# EAGLE design Single Board 12s baru v2 (EAGLE 9.6.2)
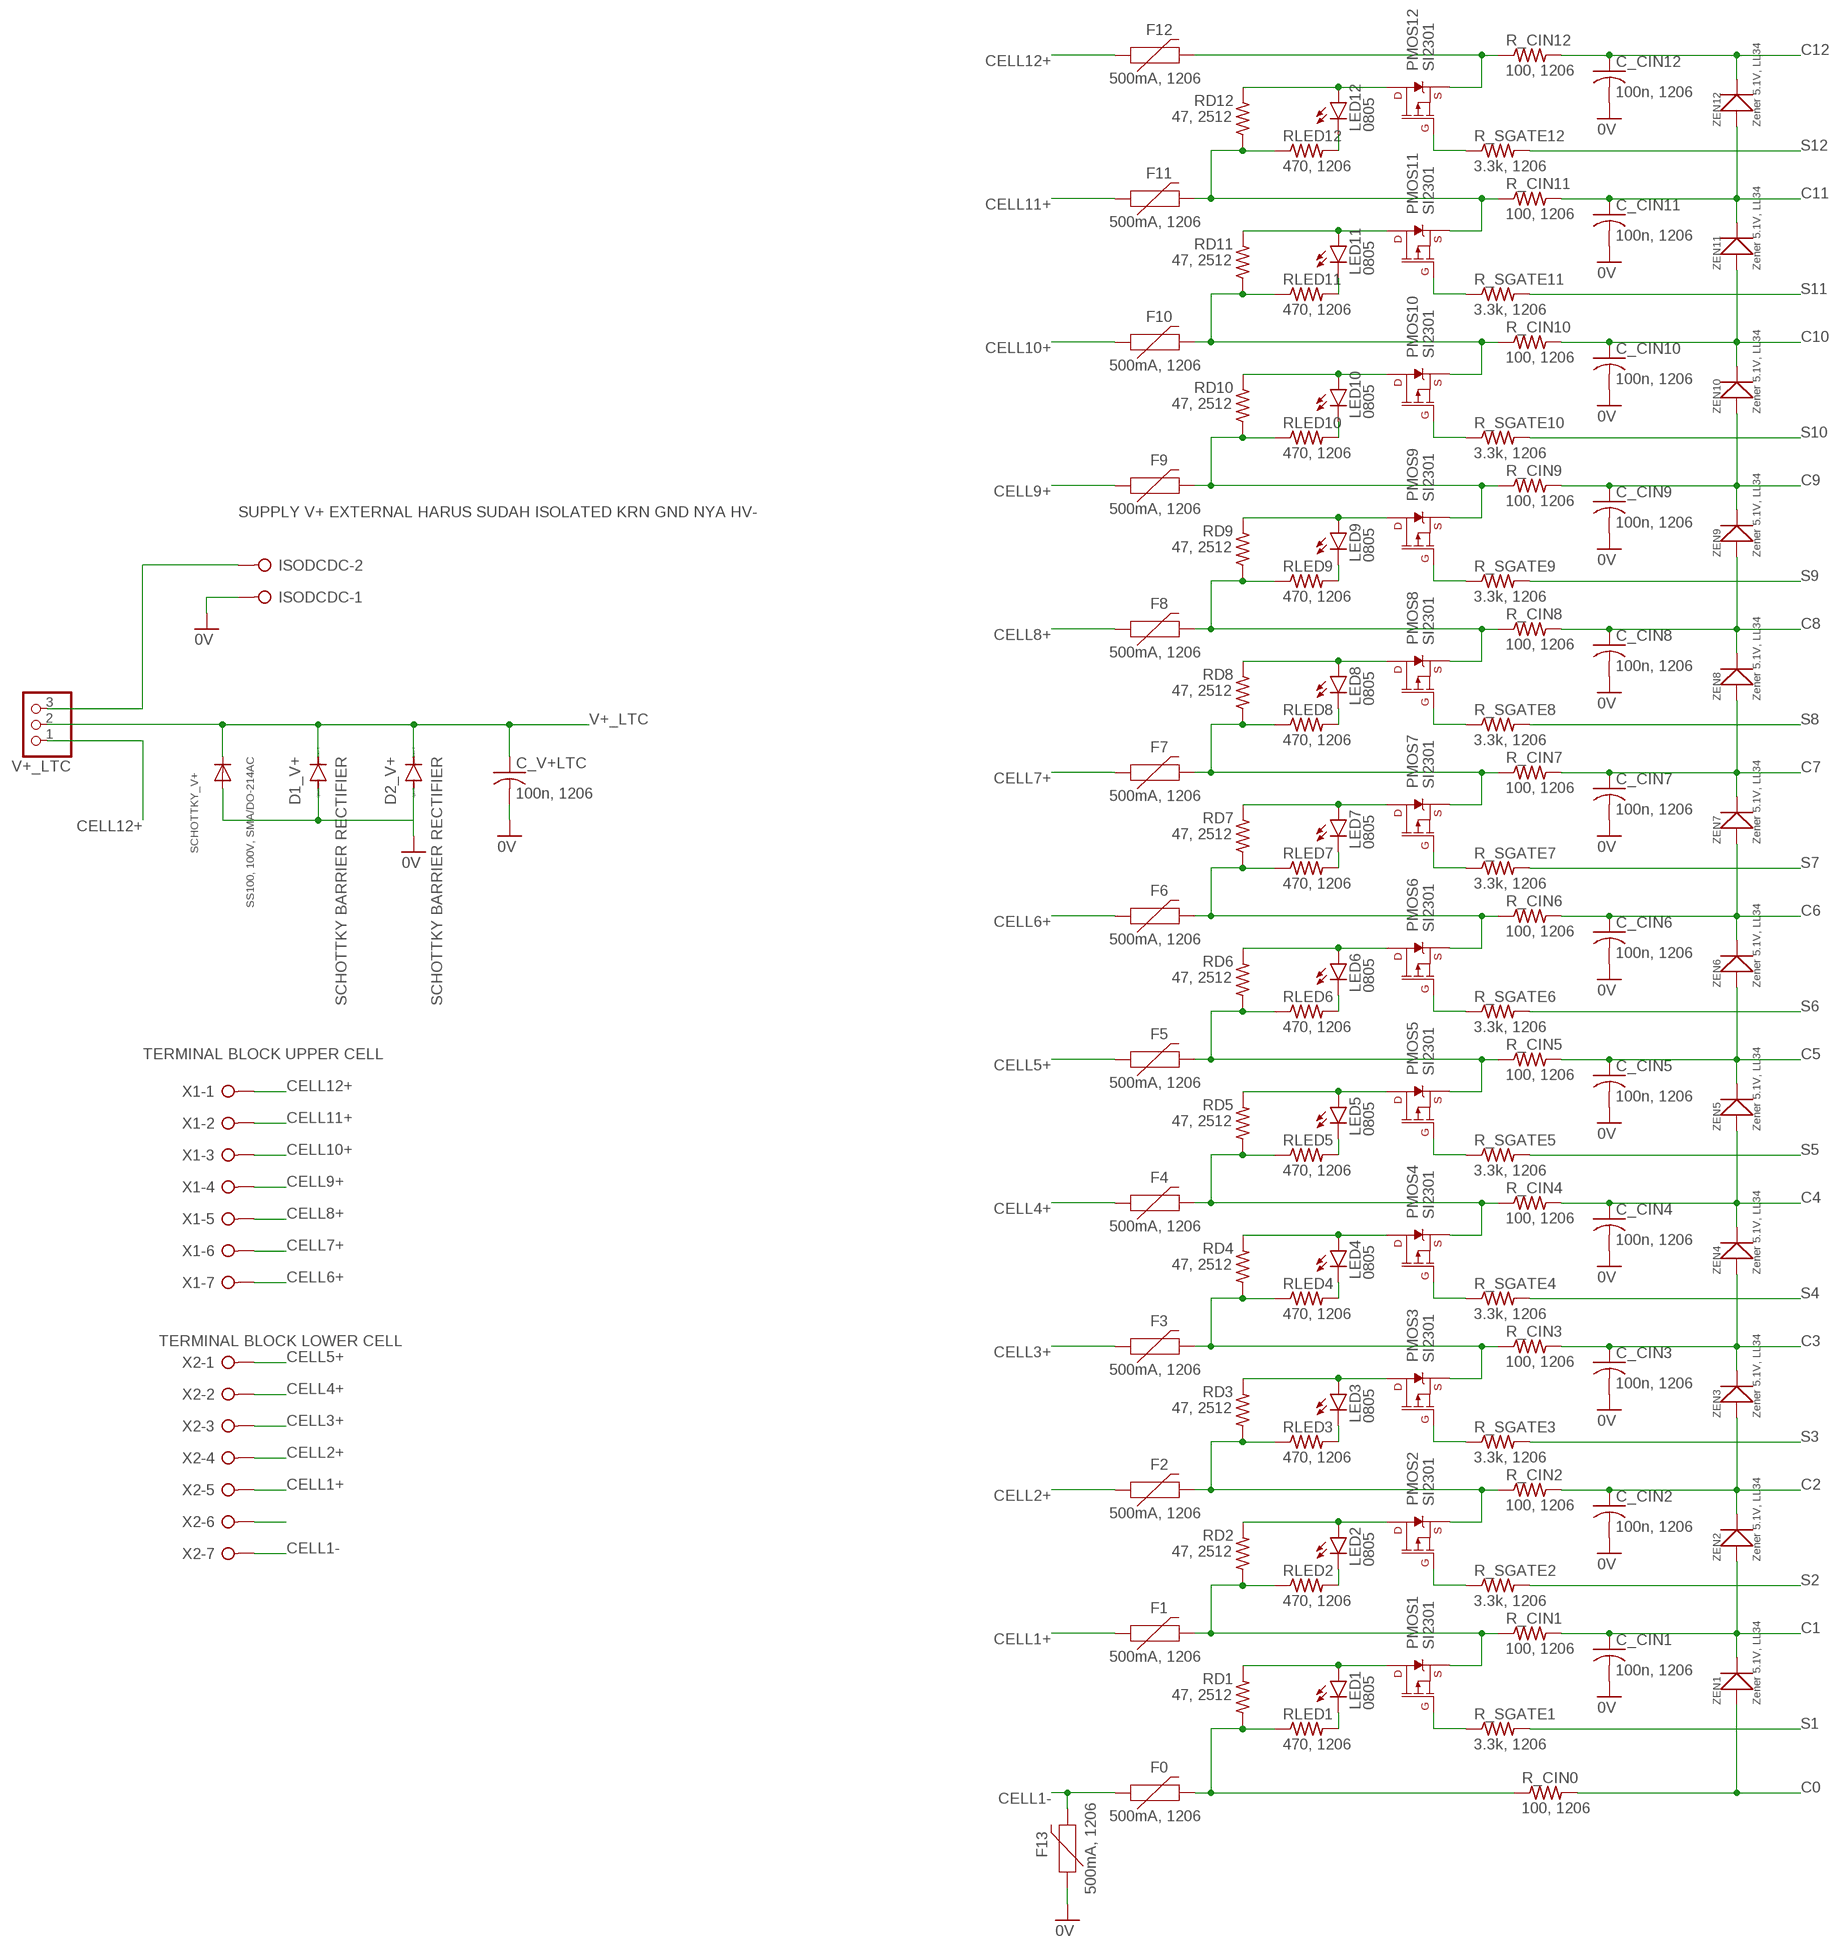
[diagram p0: schematic, sheet 1, part 1 of 2]
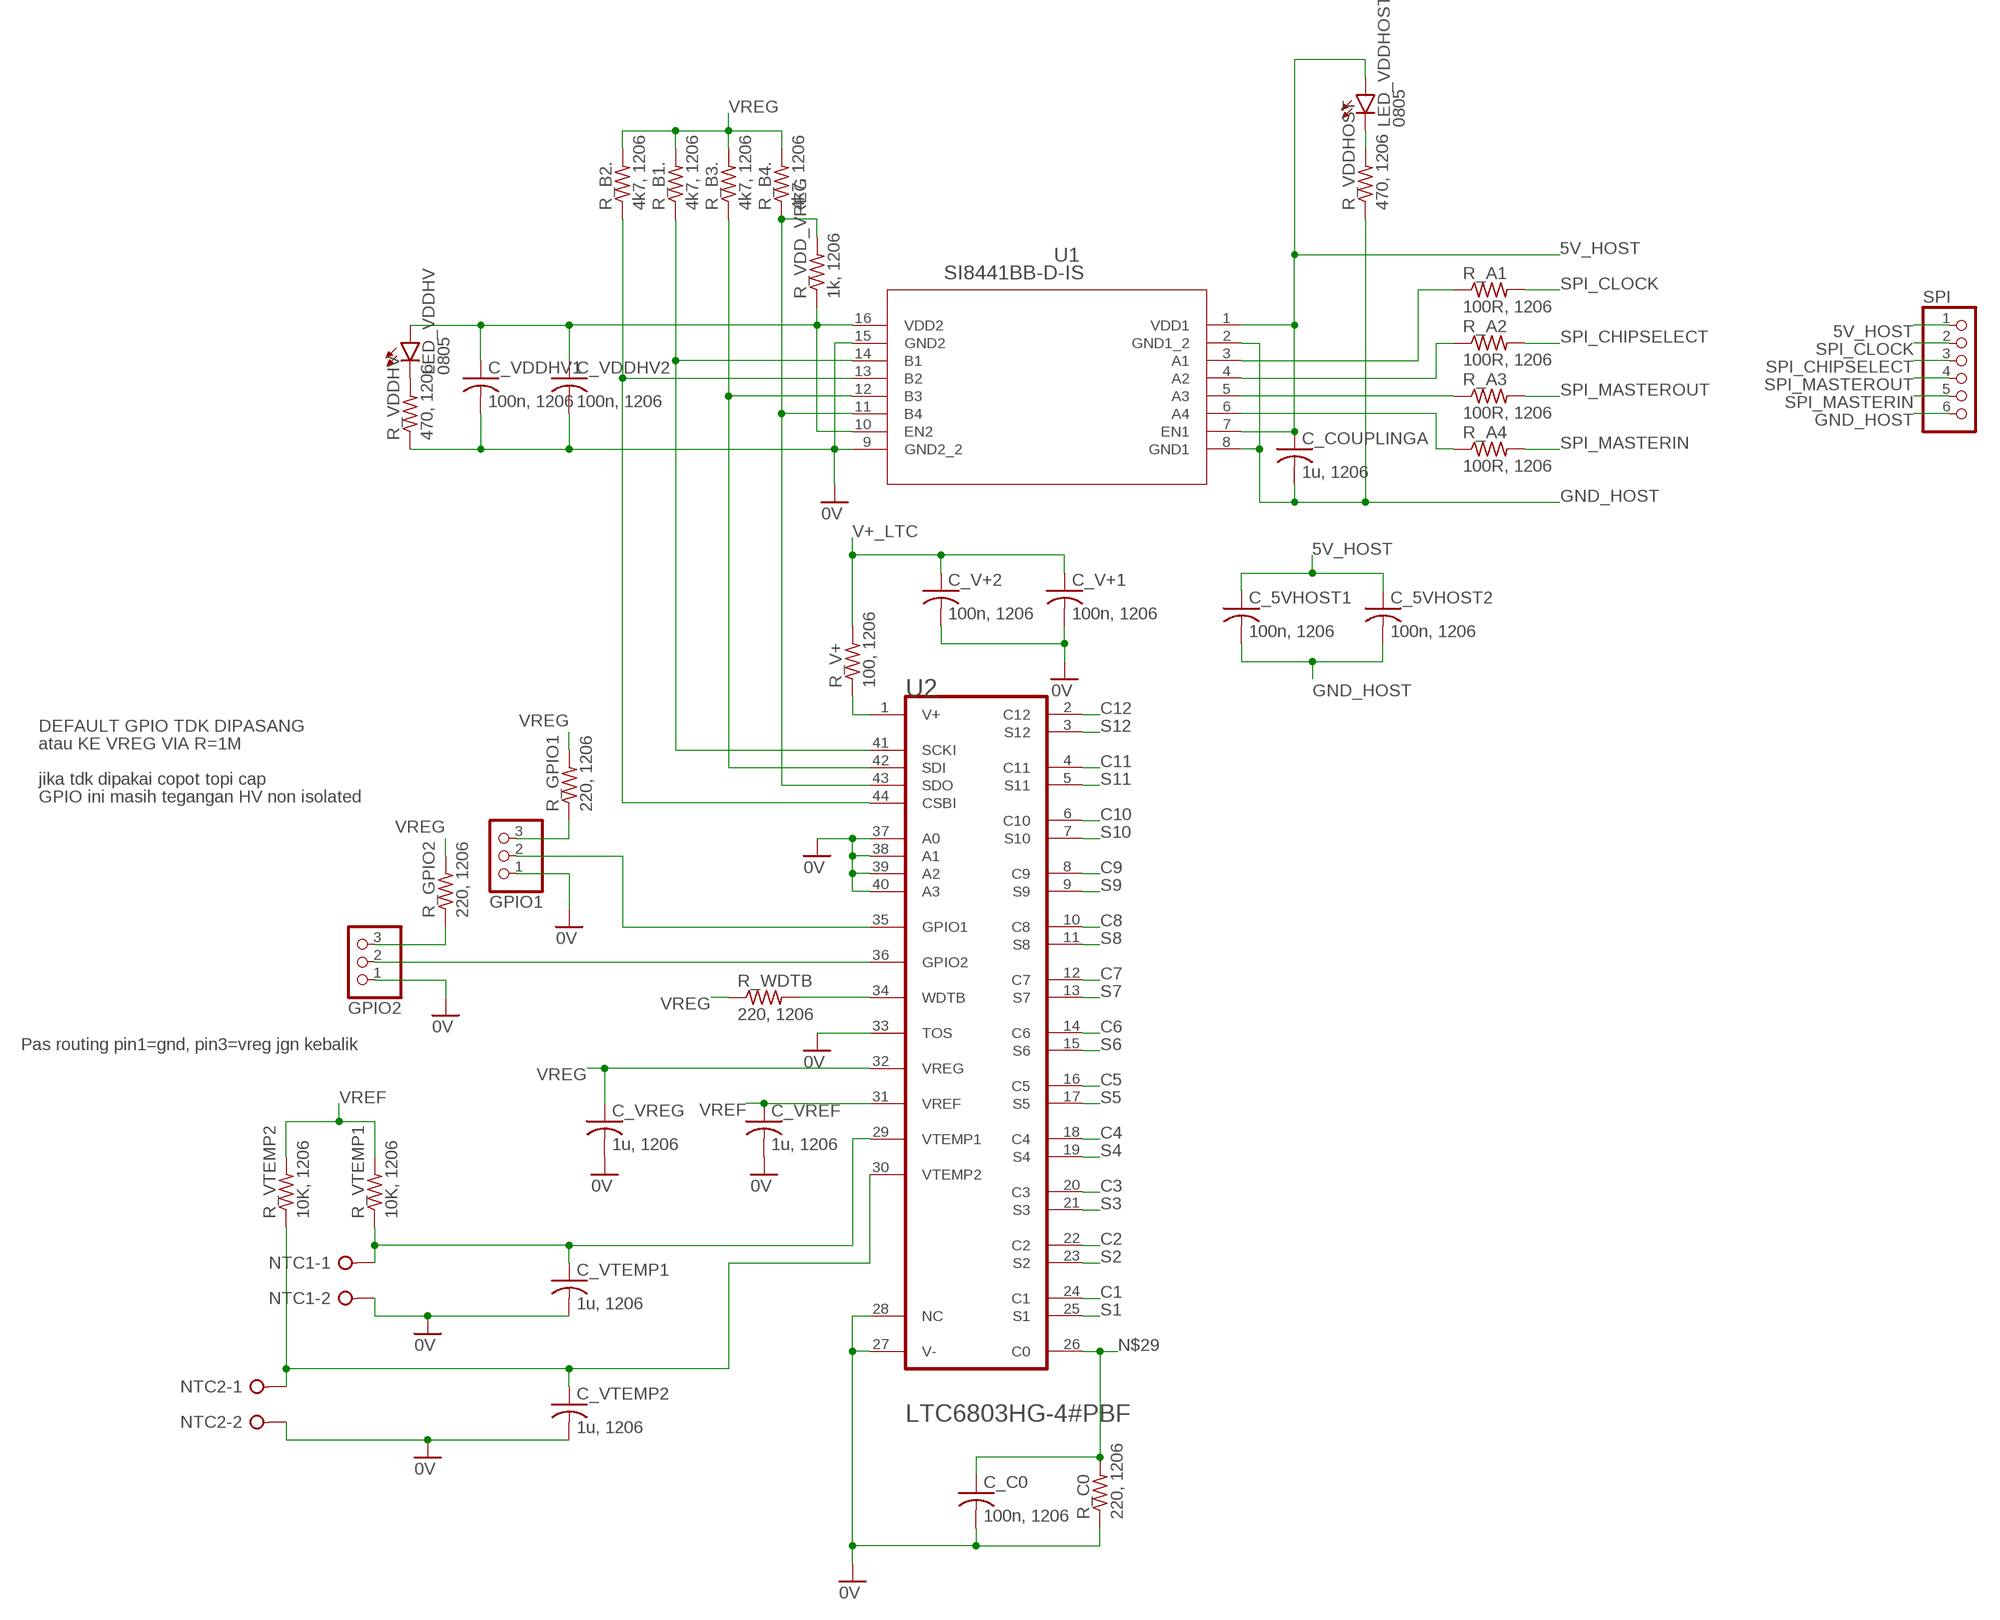
[diagram p1: schematic, sheet 1, part 2 of 2]

## Parts
C_5VHOST1  100n, 1206  C-USC1206  [C1206]
C_5VHOST2  100n, 1206  C-USC1206  [C1206]
C_C0  100n, 1206  C-USC1206  [C1206]
C_CIN1  100n, 1206  C-USC1206  [C1206]
C_CIN2  100n, 1206  C-USC1206  [C1206]
C_CIN3  100n, 1206  C-USC1206  [C1206]
C_CIN4  100n, 1206  C-USC1206  [C1206]
C_CIN5  100n, 1206  C-USC1206  [C1206]
C_CIN6  100n, 1206  C-USC1206  [C1206]
C_CIN7  100n, 1206  C-USC1206  [C1206]
C_CIN8  100n, 1206  C-USC1206  [C1206]
C_CIN9  100n, 1206  C-USC1206  [C1206]
C_CIN10  100n, 1206  C-USC1206  [C1206]
C_CIN11  100n, 1206  C-USC1206  [C1206]
C_CIN12  100n, 1206  C-USC1206  [C1206]
C_COUPLINGA  1u, 1206  C-USC1206  [C1206]
C_V+1  100n, 1206  C-USC1206  [C1206]
C_V+2  100n, 1206  C-USC1206  [C1206]
C_V+LTC  100n, 1206  C-USC1206  [C1206]
C_VDDHV1  100n, 1206  C-USC1206  [C1206]
C_VDDHV2  100n, 1206  C-USC1206  [C1206]
C_VREF  1u, 1206  C-USC1206  [C1206]
C_VREG  1u, 1206  C-USC1206  [C1206]
C_VTEMP1  1u, 1206  C-USC1206  [C1206]
C_VTEMP2  1u, 1206  C-USC1206  [C1206]
D1_V+  SCHOTTKY BARRIER RECTIFIER  DIODE-DO27-15  [DO27-15]
D2_V+  SCHOTTKY BARRIER RECTIFIER  DIODE-DO27-15  [DO27-15]
F0  500mA, 1206  PPTC_6V500MA-2  [1206]
F1  500mA, 1206  PPTC_6V500MA-2  [1206]
F2  500mA, 1206  PPTC_6V500MA-2  [1206]
F3  500mA, 1206  PPTC_6V500MA-2  [1206]
F4  500mA, 1206  PPTC_6V500MA-2  [1206]
F5  500mA, 1206  PPTC_6V500MA-2  [1206]
F6  500mA, 1206  PPTC_6V500MA-2  [1206]
F7  500mA, 1206  PPTC_6V500MA-2  [1206]
F8  500mA, 1206  PPTC_6V500MA-2  [1206]
F9  500mA, 1206  PPTC_6V500MA-2  [1206]
F10  500mA, 1206  PPTC_6V500MA-2  [1206]
F11  500mA, 1206  PPTC_6V500MA-2  [1206]
F12  500mA, 1206  PPTC_6V500MA-2  [1206]
F13  500mA, 1206  PPTC_6V500MA-2  [1206]
GPIO1  PINHD-1X3  [1X03]
GPIO2  PINHD-1X3  [1X03]
ISODCDC  W237-02P  [W237-132]
LED1  0805  LEDSML0805  [SML0805]
LED2  0805  LEDSML0805  [SML0805]
LED3  0805  LEDSML0805  [SML0805]
LED4  0805  LEDSML0805  [SML0805]
LED5  0805  LEDSML0805  [SML0805]
LED6  0805  LEDSML0805  [SML0805]
LED7  0805  LEDSML0805  [SML0805]
LED8  0805  LEDSML0805  [SML0805]
LED9  0805  LEDSML0805  [SML0805]
LED10  0805  LEDSML0805  [SML0805]
LED11  0805  LEDSML0805  [SML0805]
LED12  0805  LEDSML0805  [SML0805]
LED_VDDHOST  0805  LEDSML0805  [SML0805]
LED_VDDHV  0805  LEDSML0805  [SML0805]
NTC1  W237-02P  [W237-132]
NTC2  W237-02P  [W237-132]
PMOS1  SI2301  MOSFET_PCH-SI2309DS  [SOT23-3]
PMOS2  SI2301  MOSFET_PCH-SI2309DS  [SOT23-3]
PMOS3  SI2301  MOSFET_PCH-SI2309DS  [SOT23-3]
PMOS4  SI2301  MOSFET_PCH-SI2309DS  [SOT23-3]
PMOS5  SI2301  MOSFET_PCH-SI2309DS  [SOT23-3]
PMOS6  SI2301  MOSFET_PCH-SI2309DS  [SOT23-3]
PMOS7  SI2301  MOSFET_PCH-SI2309DS  [SOT23-3]
PMOS8  SI2301  MOSFET_PCH-SI2309DS  [SOT23-3]
PMOS9  SI2301  MOSFET_PCH-SI2309DS  [SOT23-3]
PMOS10  SI2301  MOSFET_PCH-SI2309DS  [SOT23-3]
PMOS11  SI2301  MOSFET_PCH-SI2309DS  [SOT23-3]
PMOS12  SI2301  MOSFET_PCH-SI2309DS  [SOT23-3]
R_A1  100R, 1206  R-US_R1206  [R1206]
R_A2  100R, 1206  R-US_R1206  [R1206]
R_A3  100R, 1206  R-US_R1206  [R1206]
R_A4  100R, 1206  R-US_R1206  [R1206]
R_B1.  4k7, 1206  R-US_R1206  [R1206]
R_B2.  4k7, 1206  R-US_R1206  [R1206]
R_B3.  4k7, 1206  R-US_R1206  [R1206]
R_B4.  4k7, 1206  R-US_R1206  [R1206]
R_C0  220, 1206  R-US_R1206  [R1206]
R_CIN0  100, 1206  R-US_R1206  [R1206]
R_CIN1  100, 1206  R-US_R1206  [R1206]
R_CIN2  100, 1206  R-US_R1206  [R1206]
R_CIN3  100, 1206  R-US_R1206  [R1206]
R_CIN4  100, 1206  R-US_R1206  [R1206]
R_CIN5  100, 1206  R-US_R1206  [R1206]
R_CIN6  100, 1206  R-US_R1206  [R1206]
R_CIN7  100, 1206  R-US_R1206  [R1206]
R_CIN8  100, 1206  R-US_R1206  [R1206]
R_CIN9  100, 1206  R-US_R1206  [R1206]
R_CIN10  100, 1206  R-US_R1206  [R1206]
R_CIN11  100, 1206  R-US_R1206  [R1206]
R_CIN12  100, 1206  R-US_R1206  [R1206]
R_GPIO1  220, 1206  R-US_R1206  [R1206]
R_GPIO2  220, 1206  R-US_R1206  [R1206]
R_SGATE1  3.3k, 1206  R-US_R1206  [R1206]
R_SGATE2  3.3k, 1206  R-US_R1206  [R1206]
R_SGATE3  3.3k, 1206  R-US_R1206  [R1206]
R_SGATE4  3.3k, 1206  R-US_R1206  [R1206]
R_SGATE5  3.3k, 1206  R-US_R1206  [R1206]
R_SGATE6  3.3k, 1206  R-US_R1206  [R1206]
R_SGATE7  3.3k, 1206  R-US_R1206  [R1206]
R_SGATE8  3.3k, 1206  R-US_R1206  [R1206]
R_SGATE9  3.3k, 1206  R-US_R1206  [R1206]
R_SGATE10  3.3k, 1206  R-US_R1206  [R1206]
R_SGATE11  3.3k, 1206  R-US_R1206  [R1206]
R_SGATE12  3.3k, 1206  R-US_R1206  [R1206]
R_V+  100, 1206  R-US_R1206  [R1206]
R_VDD_VREG  1k, 1206  R-US_R1206  [R1206]
R_VDDHOST  470, 1206  R-US_R1206  [R1206]
R_VDDHV  470, 1206  R-US_R1206  [R1206]
R_VTEMP1  10K, 1206  R-US_R1206  [R1206]
R_VTEMP2  10K, 1206  R-US_R1206  [R1206]
R_WDTB  220, 1206  R-US_R1206  [R1206]
RD1  47, 2512  R-US_R2512  [R2512]
RD2  47, 2512  R-US_R2512  [R2512]
RD3  47, 2512  R-US_R2512  [R2512]
RD4  47, 2512  R-US_R2512  [R2512]
RD5  47, 2512  R-US_R2512  [R2512]
RD6  47, 2512  R-US_R2512  [R2512]
RD7  47, 2512  R-US_R2512  [R2512]
RD8  47, 2512  R-US_R2512  [R2512]
RD9  47, 2512  R-US_R2512  [R2512]
RD10  47, 2512  R-US_R2512  [R2512]
RD11  47, 2512  R-US_R2512  [R2512]
RD12  47, 2512  R-US_R2512  [R2512]
RLED1  470, 1206  R-US_R1206  [R1206]
RLED2  470, 1206  R-US_R1206  [R1206]
RLED3  470, 1206  R-US_R1206  [R1206]
RLED4  470, 1206  R-US_R1206  [R1206]
RLED5  470, 1206  R-US_R1206  [R1206]
RLED6  470, 1206  R-US_R1206  [R1206]
RLED7  470, 1206  R-US_R1206  [R1206]
RLED8  470, 1206  R-US_R1206  [R1206]
RLED9  470, 1206  R-US_R1206  [R1206]
RLED10  470, 1206  R-US_R1206  [R1206]
RLED11  470, 1206  R-US_R1206  [R1206]
RLED12  470, 1206  R-US_R1206  [R1206]
SCHOTTKY_V+  SS100, 100V, SMA/DO-214AC  DIODESMA  [SMADIODE]
SPI  PINHD-1X6  [1X06]
U1  SI8441BB-D-IS  [SOIC-16W_SIL]
U2  LINEAR_TECHNOLOGY_LTC6803HG-4#PBFLINEAR_TECHNOLOGY_LTC6803HG-4#PBF_0_2  [LINEAR_TECHNOLOGY_LTC6803HG-4#PBF_2]
V+_LTC  PINHD-1X3  [1X03]
X1  W237-07P  [W237-7P]
X2  W237-07P  [W237-7P]
ZEN1  Zener 5.1V, LL34  SMD-DIODE-SWITCHING-75V-200MA(LL-34)  [LL-34]
ZEN2  Zener 5.1V, LL34  SMD-DIODE-SWITCHING-75V-200MA(LL-34)  [LL-34]
ZEN3  Zener 5.1V, LL34  SMD-DIODE-SWITCHING-75V-200MA(LL-34)  [LL-34]
ZEN4  Zener 5.1V, LL34  SMD-DIODE-SWITCHING-75V-200MA(LL-34)  [LL-34]
ZEN5  Zener 5.1V, LL34  SMD-DIODE-SWITCHING-75V-200MA(LL-34)  [LL-34]
ZEN6  Zener 5.1V, LL34  SMD-DIODE-SWITCHING-75V-200MA(LL-34)  [LL-34]
ZEN7  Zener 5.1V, LL34  SMD-DIODE-SWITCHING-75V-200MA(LL-34)  [LL-34]
ZEN8  Zener 5.1V, LL34  SMD-DIODE-SWITCHING-75V-200MA(LL-34)  [LL-34]
ZEN9  Zener 5.1V, LL34  SMD-DIODE-SWITCHING-75V-200MA(LL-34)  [LL-34]
ZEN10  Zener 5.1V, LL34  SMD-DIODE-SWITCHING-75V-200MA(LL-34)  [LL-34]
ZEN11  Zener 5.1V, LL34  SMD-DIODE-SWITCHING-75V-200MA(LL-34)  [LL-34]
ZEN12  Zener 5.1V, LL34  SMD-DIODE-SWITCHING-75V-200MA(LL-34)  [LL-34]

## Nets
0V: C_C0.2 C_CIN1.2 C_CIN2.2 C_CIN3.2 C_CIN4.2 C_CIN5.2 C_CIN6.2 C_CIN7.2 C_CIN8.2 C_CIN9.2 C_CIN10.2 C_CIN11.2 C_CIN12.2 C_V+1.2 C_V+2.2 C_V+LTC.2 C_VDDHV1.2 C_VDDHV2.2 C_VREF.2 C_VREG.2 C_VTEMP1.2 C_VTEMP2.2 D1_V+.A D2_V+.A F13.1 GPIO1.1 GPIO2.1 ISODCDC.1 NTC1.2 NTC2.2 R_C0.1 R_VDDHV.1 SCHOTTKY_V+.A U1.9(GND2_2) U1.15(GND2) U2.27(V-) U2.28(NC) U2.33(TOS) U2.37(A0) U2.38(A1) U2.39(A2) U2.40(A3)
5V_HOST: C_5VHOST1.1 C_5VHOST2.1 C_COUPLINGA.1 LED_VDDHOST.A SPI.1 U1.1(VDD1) U1.7(EN1)
C0: R_CIN0.2 ZEN1.A(+)
C1: C_CIN1.1 R_CIN1.2 U2.24(C1) ZEN1.C(-) ZEN2.A(+)
C2: C_CIN2.1 R_CIN2.2 U2.22(C2) ZEN2.C(-) ZEN3.A(+)
C3: C_CIN3.1 R_CIN3.2 U2.20(C3) ZEN3.C(-) ZEN4.A(+)
C4: C_CIN4.1 R_CIN4.2 U2.18(C4) ZEN4.C(-) ZEN5.A(+)
C5: C_CIN5.1 R_CIN5.2 U2.16(C5) ZEN5.C(-) ZEN6.A(+)
C6: C_CIN6.1 R_CIN6.2 U2.14(C6) ZEN6.C(-) ZEN7.A(+)
C7: C_CIN7.1 R_CIN7.2 U2.12(C7) ZEN7.C(-) ZEN8.A(+)
C8: C_CIN8.1 R_CIN8.2 U2.10(C8) ZEN8.C(-) ZEN9.A(+)
C9: C_CIN9.1 R_CIN9.2 U2.8(C9) ZEN9.C(-) ZEN10.A(+)
C10: C_CIN10.1 R_CIN10.2 U2.6(C10) ZEN10.C(-) ZEN11.A(+)
C11: C_CIN11.1 R_CIN11.2 U2.4(C11) ZEN11.C(-) ZEN12.A(+)
C12: C_CIN12.1 R_CIN12.2 U2.2(C12) ZEN12.C(-)
CELL1+: F1.1 X2.5
CELL1-: F0.1 F13.2 X2.7
CELL2+: F2.1 X2.4
CELL3+: F3.1 X2.3
CELL4+: F4.1 X2.2
CELL5+: F5.1 X2.1
CELL6+: F6.1 X1.7
CELL7+: F7.1 X1.6
CELL8+: F8.1 X1.5
CELL9+: F9.1 X1.4
CELL10+: F10.1 X1.3
CELL11+: F11.1 X1.2
CELL12+: F12.1 V+_LTC.1 X1.1
GND_HOST: C_5VHOST1.2 C_5VHOST2.2 C_COUPLINGA.2 R_VDDHOST.1 SPI.6 U1.2(GND1_2) U1.8(GND1)
N$1: R_V+.1 U2.1(V+)
N$2: PMOS1.1(G) R_SGATE1.1
N$3: LED1.A PMOS1.3(D) RD1.2
N$4: R_A2.1 U1.4(A2)
N$5: LED_VDDHOST.C R_VDDHOST.2
N$6: LED1.C RLED1.2
N$7: F0.2 R_CIN0.1 RD1.1 RLED1.1
N$8: R_WDTB.2 U2.34(WDTB)
N$9: ISODCDC.2 V+_LTC.3
N$10: LED_VDDHV.C R_VDDHV.2
N$12: PMOS2.1(G) R_SGATE2.1
N$15: R_B4..1 R_VDD_VREG.2 U1.11(B4) U2.43(SDO)
N$16: LED2.A PMOS2.3(D) RD2.2
N$17: LED2.C RLED2.2
N$18: F1.2 PMOS1.2(S) R_CIN1.1 RD2.1 RLED2.1
N$19: R_B3..1 U1.12(B3) U2.42(SDI)
N$20: R_B2..1 U1.13(B2) U2.44(CSBI)
N$21: PMOS3.1(G) R_SGATE3.1
N$22: R_B1..1 U1.14(B1) U2.41(SCKI)
N$23: R_A3.1 U1.5(A3)
N$24: R_A1.1 U1.3(A1)
N$25: LED3.A PMOS3.3(D) RD3.2
N$26: LED3.C RLED3.2
N$27: F2.2 PMOS2.2(S) R_CIN2.1 RD3.1 RLED3.1
N$28: R_A4.1 U1.6(A4)
N$29: C_C0.1 R_C0.2 U2.26(C0)
N$30: PMOS4.1(G) R_SGATE4.1
N$31: GPIO2.2 U2.36(GPIO2)
N$32: GPIO1.2 U2.35(GPIO1)
N$33: C_VTEMP2.1 NTC2.1 R_VTEMP2.1 U2.30(VTEMP2)
N$34: LED4.A PMOS4.3(D) RD4.2
N$35: LED4.C RLED4.2
N$36: F3.2 PMOS3.2(S) R_CIN3.1 RD4.1 RLED4.1
N$37: C_VTEMP1.1 NTC1.1 R_VTEMP1.1 U2.29(VTEMP1)
N$38: GPIO2.3 R_GPIO2.1
N$39: PMOS5.1(G) R_SGATE5.1
N$40: GPIO1.3 R_GPIO1.1
N$43: LED5.A PMOS5.3(D) RD5.2
N$44: LED5.C RLED5.2
N$45: F4.2 PMOS4.2(S) R_CIN4.1 RD5.1 RLED5.1
N$48: PMOS6.1(G) R_SGATE6.1
N$51: X2.6
N$52: LED6.A PMOS6.3(D) RD6.2
N$53: LED6.C RLED6.2
N$54: F5.2 PMOS5.2(S) R_CIN5.1 RD6.1 RLED6.1
N$57: PMOS7.1(G) R_SGATE7.1
N$61: LED7.A PMOS7.3(D) RD7.2
N$62: LED7.C RLED7.2
N$63: F6.2 PMOS6.2(S) R_CIN6.1 RD7.1 RLED7.1
N$66: PMOS8.1(G) R_SGATE8.1
N$70: LED8.A PMOS8.3(D) RD8.2
N$71: LED8.C RLED8.2
N$72: F7.2 PMOS7.2(S) R_CIN7.1 RD8.1 RLED8.1
N$75: PMOS9.1(G) R_SGATE9.1
N$79: LED9.A PMOS9.3(D) RD9.2
N$80: LED9.C RLED9.2
N$81: F8.2 PMOS8.2(S) R_CIN8.1 RD9.1 RLED9.1
N$84: PMOS10.1(G) R_SGATE10.1
N$88: LED10.A PMOS10.3(D) RD10.2
N$89: LED10.C RLED10.2
N$90: F9.2 PMOS9.2(S) R_CIN9.1 RD10.1 RLED10.1
N$93: PMOS11.1(G) R_SGATE11.1
N$97: LED11.A PMOS11.3(D) RD11.2
N$98: LED11.C RLED11.2
N$99: F10.2 PMOS10.2(S) R_CIN10.1 RD11.1 RLED11.1
N$102: PMOS12.1(G) R_SGATE12.1
N$105: F12.2 PMOS12.2(S) R_CIN12.1
N$106: LED12.A PMOS12.3(D) RD12.2
N$107: LED12.C RLED12.2
N$108: F11.2 PMOS11.2(S) R_CIN11.1 RD12.1 RLED12.1
S1: R_SGATE1.2 U2.25(S1)
S2: R_SGATE2.2 U2.23(S2)
S3: R_SGATE3.2 U2.21(S3)
S4: R_SGATE4.2 U2.19(S4)
S5: R_SGATE5.2 U2.17(S5)
S6: R_SGATE6.2 U2.15(S6)
S7: R_SGATE7.2 U2.13(S7)
S8: R_SGATE8.2 U2.11(S8)
S9: R_SGATE9.2 U2.9(S9)
S10: R_SGATE10.2 U2.7(S10)
S11: R_SGATE11.2 U2.5(S11)
S12: R_SGATE12.2 U2.3(S12)
SPI_CHIPSELECT: R_A2.2 SPI.3
SPI_CLOCK: R_A1.2 SPI.2
SPI_MASTERIN: R_A4.2 SPI.5
SPI_MASTEROUT: R_A3.2 SPI.4
V+_LTC: C_V+1.1 C_V+2.1 C_V+LTC.1 D1_V+.C D2_V+.C R_V+.2 SCHOTTKY_V+.C V+_LTC.2
VREF: C_VREF.1 R_VTEMP1.2 R_VTEMP2.2 U2.31(VREF)
VREG: C_VDDHV1.1 C_VDDHV2.1 C_VREG.1 LED_VDDHV.A R_B1..2 R_B2..2 R_B3..2 R_B4..2 R_GPIO1.2 R_GPIO2.2 R_VDD_VREG.1 R_WDTB.1 U1.10(EN2) U1.16(VDD2) U2.32(VREG)

## Notes on the sheet
- SUPPLY V+ EXTERNAL HARUS SUDAH ISOLATED KRN GND NYA HV-
- DEFAULT GPIO TDK DIPASANG
- atau KE VREG VIA R=1M
- jika tdk dipakai copot topi cap
- TERMINAL BLOCK UPPER CELL | GPIO ini masih tegangan HV non isolated
- Pas routing pin1=gnd, pin3=vreg jgn kebalik
- TERMINAL BLOCK LOWER CELL

## Library data of the parts
C_5VHOST1 C_5VHOST2 C_C0 C_CIN1-C_CIN12 C_COUPLINGA C_V+1 C_V+2 C_V+LTC C_VDDHV1 C_VDDHV2 C_VREF C_VREG C_VTEMP1 C_VTEMP2 = rcl:C-US: CAPACITOR, American symbol; SPICEPREFIX: C
D1_V+ D2_V+ = diode:DIODE-: DIODE
F0 F1-F13 = SparkFun-Fuses:PPTC: Resettable Fuse PPTC Resettable Fuse. Really a sort of resistor with a polymeric positive temperature coefficient whose resistance increases dramatically with an increase in temperature. When heated by the power passing through the resistance rises causing the current to be limited, protecting the circuit. This is achieved by the transition of the polymer from a crystalline to an amorphous state where the conductive carbon separates breaking the conductive pathways found in the cool crystalline structure. When a PPTC cools back down it resumes conducting letting the circuit turn back on. SparkFun Products: SparkFun RedBoard - Programmed with Arduino <https://www.sparkfun.com/products/12757> Pro Micro - 5V/16MHz <https://www.sparkfun.com/products/12640> Arduino Pro 328 - 5V/16MHz <https://www.sparkfun.com/products/10915> MP3 Trigger <https://www.sparkfun.com/products/13720>; PROD_ID: RES-08585; VALUE: 6V/0.5A
GPIO1 GPIO2 V+_LTC = pinhead:PINHD-1X3: PIN HEADER
ISODCDC NTC1 NTC2 = con-wago-508:W237-02P: WAGO SREW CLAMP; OC_FARNELL: unknown; OC_NEWARK: unknown
LED1-LED12 LED_VDDHOST LED_VDDHV = led:LED: LED OSRAM: - CHIPLED LG R971, LG N971, LY N971, LG Q971, LY Q971, LO R971, LY R971 LH N974, LH R974 LS Q976, LO Q976, LY Q976 LO Q996 - Hyper CHIPLED LW Q18S LB Q993, LB Q99A, LB R99A - SideLED LS A670, LO A670, LY A670, LG A670, LP A670 LB A673, LV A673, LT A673, LW A673 LH A674 LY A675 LS A676, LA A676, LO A676, LY A676, LW A676 LS A679, LY A679, LG A679 - Hyper Micro SIDELED® LS Y876, LA Y876, LO Y876, LY Y876 LT Y87S - SmartLED LW L88C, LW L88S LB L89C, LB L89S, LG L890 LS L89K, LO L89K, LY L89K LS L896, LA L896, LO L896, LY L896 - TOPLED LS T670, LO T670, LY T670, LG T670, LP T670 LSG T670, LSP T670, LSY T670, LOP T670, LYG T670 LG T671, LOG T671, LSG T671 LB T673, LV T673, LT T673, LW T673 LH T674 LS T676, LA T676, LO T676, LY T676, LB T676, LH T676, LSB T676, LW T676 LB T67C, LV T67C, LT T67C, LS T67K, LO T67K, LY T67K, LW E67C LS E67B, LA E67B, LO E67B, LY E67B, LB E67C, LV E67C, LT E67C LW T67C LS T679, LY T679, LG T679 LS T770, LO T770, LY T770, LG T770, LP T770 LB T773, LV T773, LT T773, LW T773 LH T774 LS E675, LA E675, LY E675, LS T675 LS T776, LA T776, LO T776, LY T776, LB T776 LHGB T686 LT T68C, LB T68C - Hyper Mini TOPLED® LB M676 - Mini TOPLED Santana® LG M470 LS M47K, LO M47K, LY M47K Source: http://www.osram.convergy.de LUXEON: - LUMILED® LXK2-PW12-R00, LXK2-PW12-S00, LXK2-PW14-U00, LXK2-PW14-V00 LXK2-PM12-R00, LXK2-PM12-S00, LXK2-PM14-U00 LXK2-PE12-Q00, LXK2-PE12-R00, LXK2-PE12-S00, LXK2-PE14-T00, LXK2-PE14-U00 LXK2-PB12-K00, LXK2-PB12-L00, LXK2-PB12-M00, LXK2-PB14-N00, LXK2-PB14-P00, LXK2-PB14-Q00 LXK2-PR12-L00, LXK2-PR12-M00, LXK2-PR14-Q00, LXK2-PR14-R00 LXK2-PD12-Q00, LXK2-PD12-R00, LXK2-PD12-S00 LXK2-PH12-R00, LXK2-PH12-S00 LXK2-PL12-P00, LXK2-PL12-Q00, LXK2-PL12-R00 Source: www.luxeon.com KINGBRIGHT: KA-3528ASYC Source: www.kingbright.com
PMOS1-PMOS12 = SparkFun-DiscreteSemi:MOSFET_PCH: P-channel MOSFETs Voltage controlled devices that allow control of high current outputs. SparkFun Products: SparkFun ESP32 Thing <https://www.sparkfun.com/products/13907> SparkFun ESP8266 Thing <https://www.sparkfun.com/products/13231> SparkFun Pi Servo HAT V2 <https://www.sparkfun.com/products/15316> DMG2305UX-7 (20V/4.2A/SOT23-3); PROD_ID: TRANS-08285; VALUE: 1.1A/60V/600mΩ
R_A1-R_A4 R_B1. R_B2. R_B3. R_B4. R_C0 R_CIN0 R_CIN1-R_CIN12 R_GPIO1 R_GPIO2 R_SGATE1-R_SGATE12 R_V+ R_VDD_VREG R_VDDHOST R_VDDHV R_VTEMP1 R_VTEMP2 R_WDTB RD1-RD12 RLED1-RLED12 = rcl:R-US_: RESISTOR, American symbol; SPICEPREFIX: R
SCHOTTKY_V+ = adafruit:DIODE: Diode SMADIODE - SMA Surface Mount Package 20V 1A Schottky Diode Digikey: 641-1014-6-ND DO-1N4148 - Through Hole Small Current Diode SOD-123 20V 1 A (.5mV Vf) Schottky Diode - Digikey: MBRX120TPMSCT-ND SOD-323 10V 570mA (.38mV Vf, 3ns) Schottky Diode - Digikey: ZLLS410CT-ND SOD-523 30V 30mA Schottky Diode (RB751S-40TE61) - Digikey: RB751S-40TE61CT-ND SOT23-R/W - SOT23 Package (R = Solder Paste/Reflow Ovens, W = Hand-Soldering) BAT54Film 40V 300mA - Digikey: 497-7162-1-ND
SPI = pinhead:PINHD-1X6: PIN HEADER
U1 = SI8441BB:SI8441BB-D-IS; COPYRIGHT: Copyright (C) 2021 Ultra Librarian. All rights reserved.; DIGI-KEY_PART_NUMBER_1: 336-1762-5-ND; MANUFACTURER_PART_NUMBER: SI8441BB-D-IS; MFR_NAME: Silicon Labs
U2 = Linear Technology - LTC6803HG-4#PBF:LINEAR_TECHNOLOGY_LTC6803HG-4#PBF: LT-LTC6803-4-G-44; BATTERY_CHEMISTRY: Li-Ion, Supercapacitors, Multi-Chemistry; CIIVA_IDS: 1416646; COMPONENT_LINK_1_DESCRIPTION: Manufacturer URL; COMPONENT_LINK_1_URL: http://www.linear.com/; COMPONENT_LINK_3_DESCRIPTION: Package Specification; COMPONENT_LINK_3_URL: http://cds.linear.com/docs/en/packaging/SSOP_44_05-08-1754.pdf; DATASHEET: http://cds.linear.com/docs/en/datasheet/680324fa.pdf; DATASHEET_VERSION: Rev. A; FOOTPRINT_VARIANT_NAME_0: Level C; FOOTPRINT_VARIANT_NAME_1: Level B; FOOTPRINT_VARIANT_NAME_2: Level A; IMPORTED: yes; IMPORTED_FROM: vault; IMPORT_TS: 1521854382; MF: Linear Technology; MOUNTING_TECHNOLOGY: Surface Mount; MPN: LTC6803HG-4#PBF; NUMBER_OF_CELLS: > 1000 V of stacked Li-Ion cells; PACKAGE: G-44; PACKAGE_DESCRIPTION: 44-Pin Plastic SSOP, Body 12.8 x 5.3 mm, Pitch 0.5 mm; PACKAGE_VERSION: Rev. Ã ̃, 06/2010; PIN_0_0_40_INSIDE_EDGE: clock; PREFIX: U; RELEASE_DATE: 1377764895; ROHS: Yes; TYPE_OF_CHARGER: Battery Stack Monitor; VAULT_GUID: BA7F31F3-B2E0-4312-B550-1E6C11B00551; VAULT_REVISION: 890CB210-B5D1-4A20-8471-0AD6F7E52161; VIN_MAXV: 60
X1 X2 = con-wago-508:W237-07P: WAGO SREW CLAMP; OC_FARNELL: unknown; OC_NEWARK: unknown
ZEN1-ZEN12 = Zener SMD LL-34:SMD-DIODE-SWITCHING-75V-200MA(LL-34): 304040011; MPN: LL4148ST; VALUE: 75V-200MA

## Board
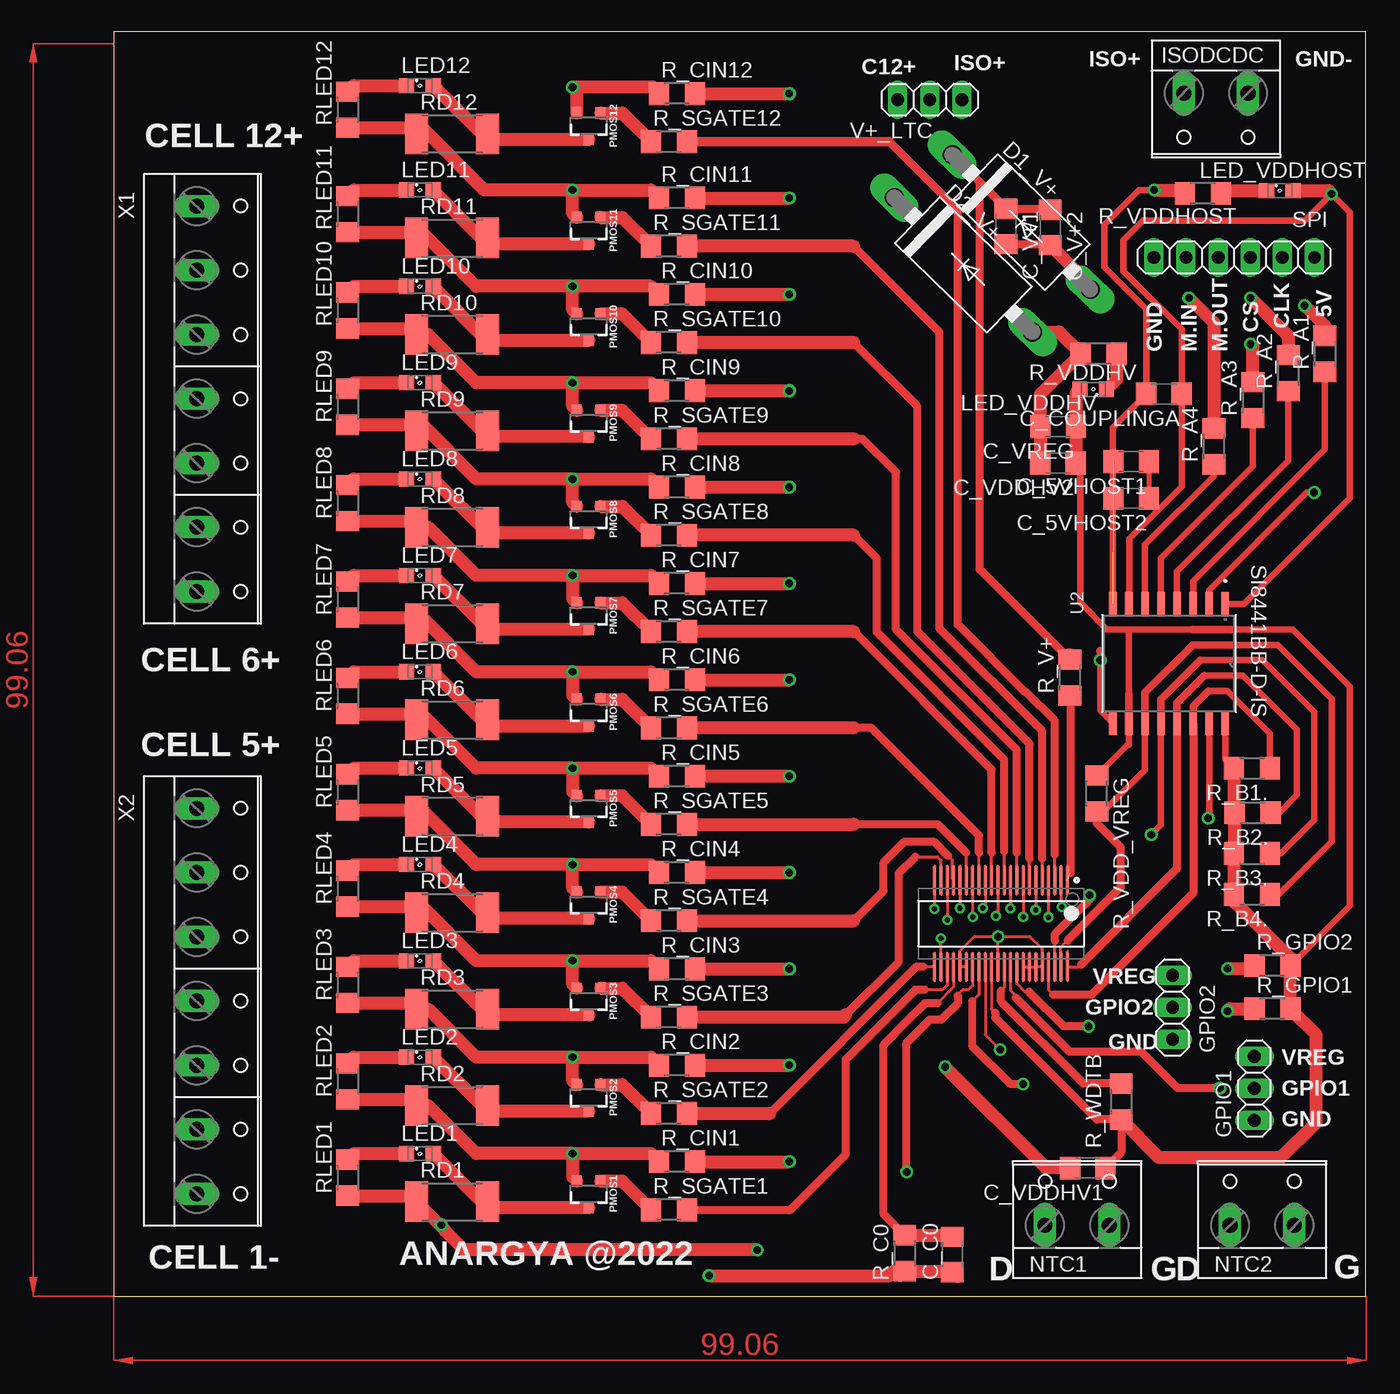
[diagram p2: board, top side]
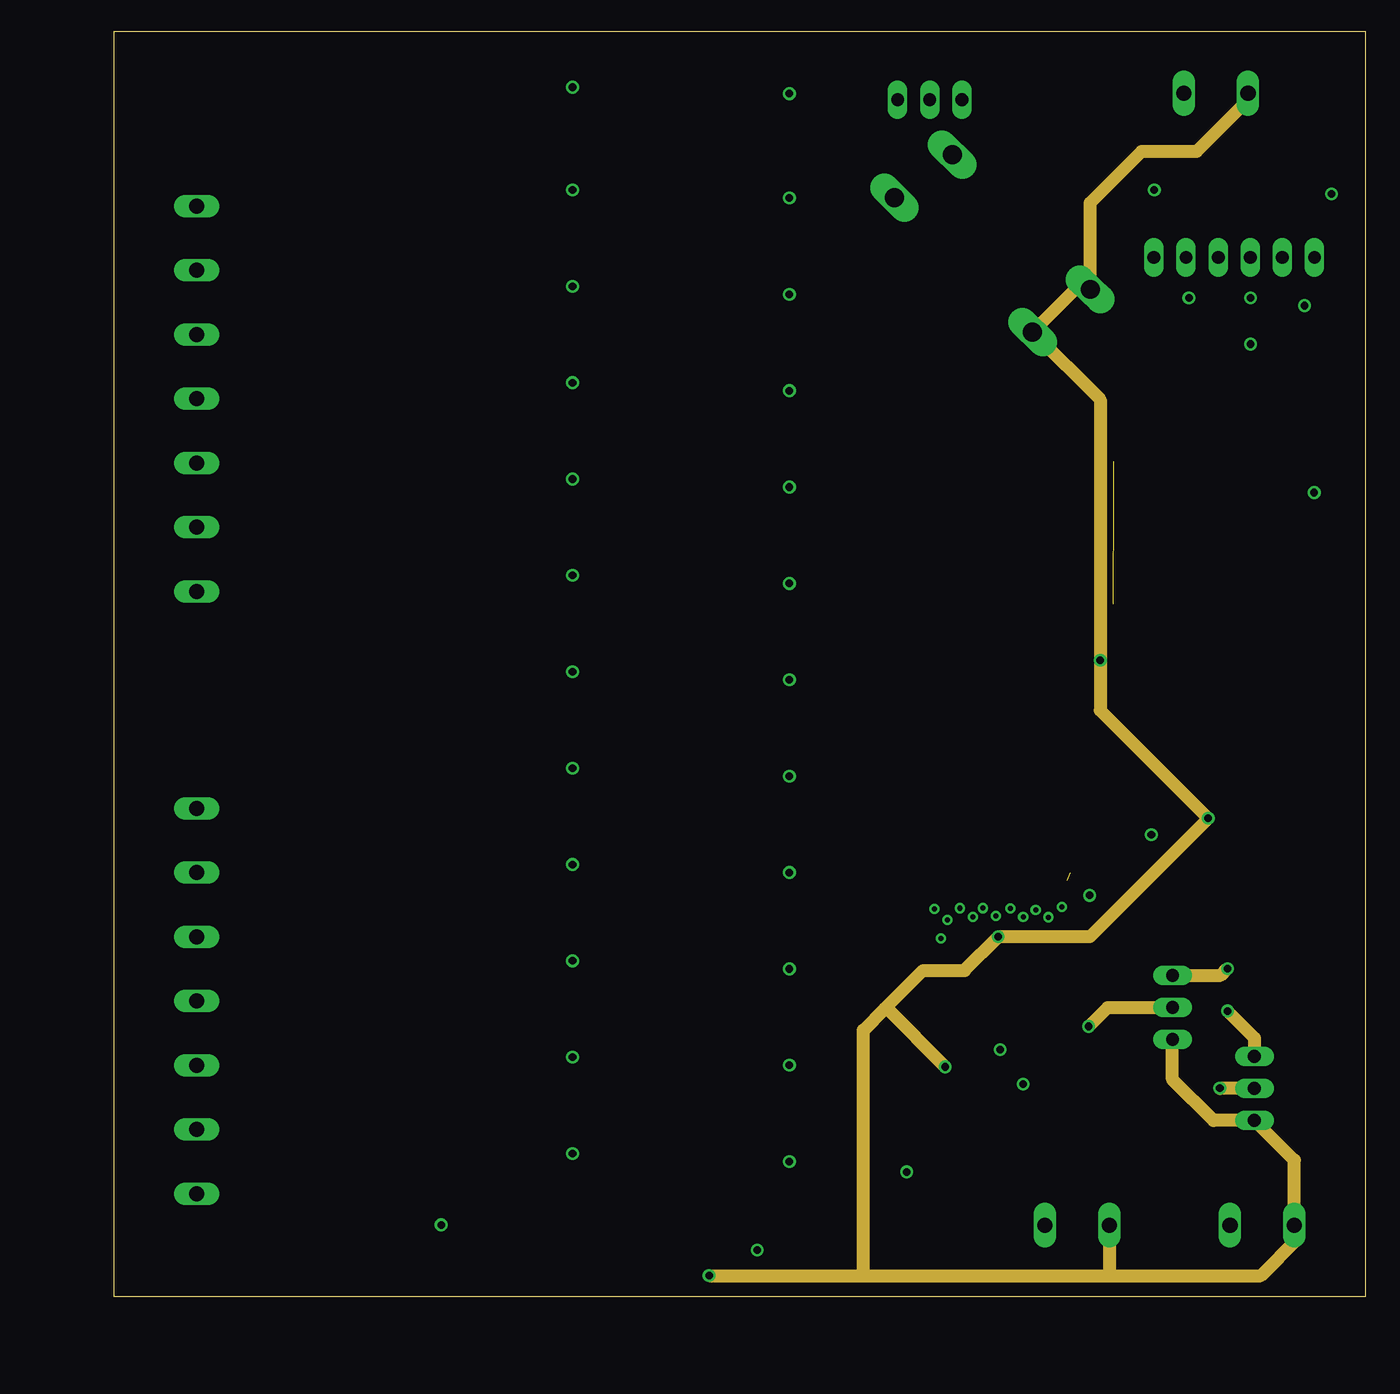
[diagram p3: board, inner layer Layer2]
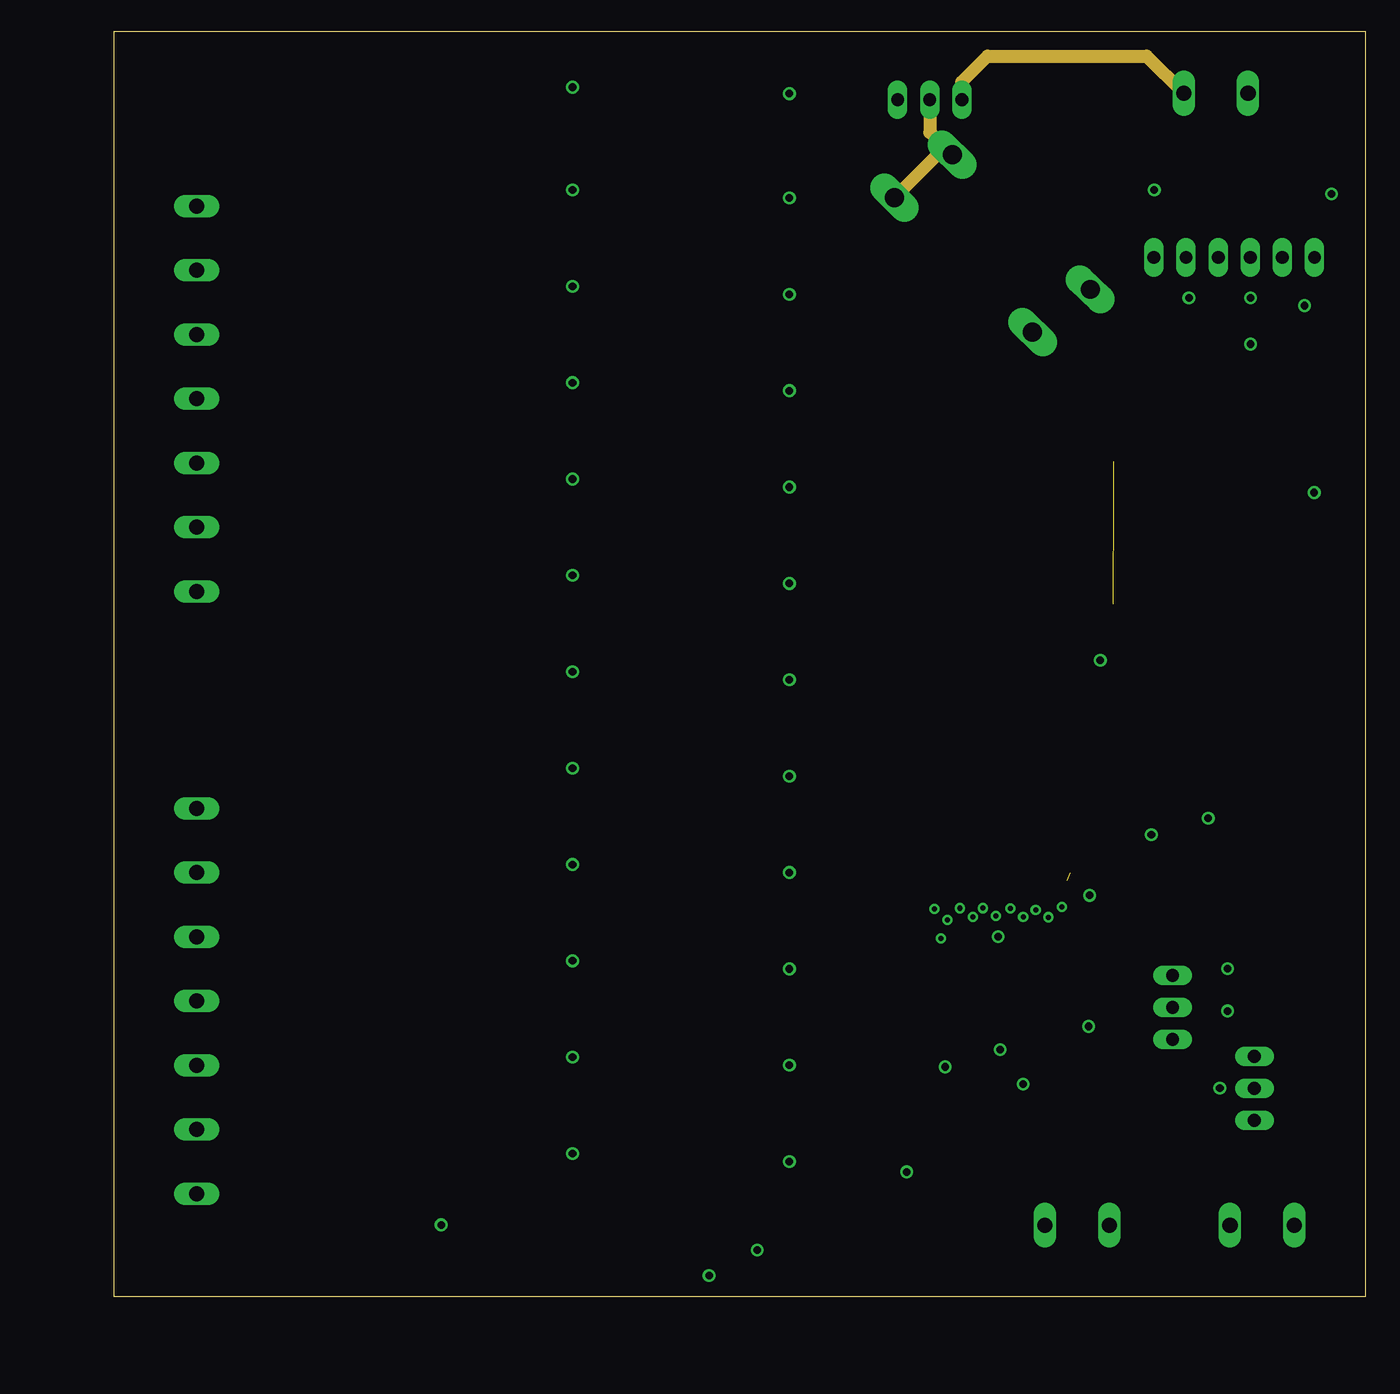
[diagram p4: board, inner layer Layer3]
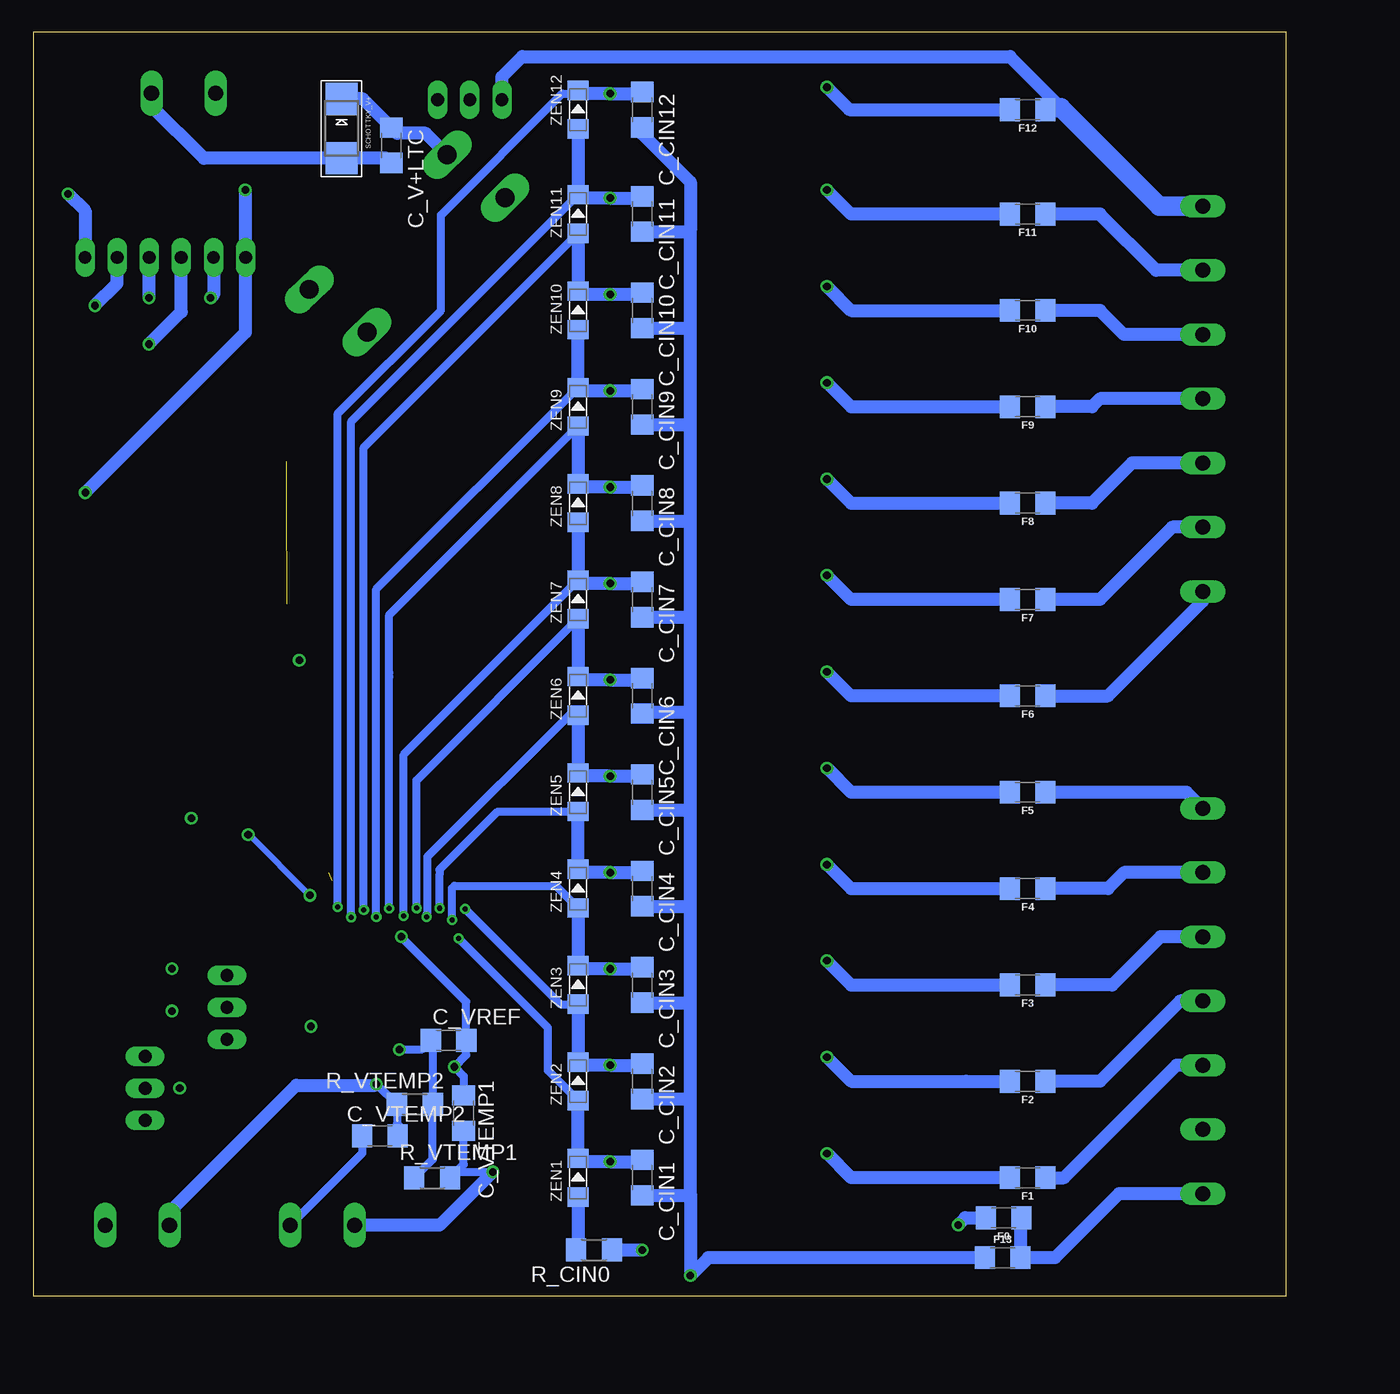
[diagram p5: board, bottom side, seen from below]

Size 99.04 x 100 mm. Coordinates in mm from the lower left corner, seen from the top.
Outline: 0,0 99.04,0 99.04,100 0,100 0,0
Copper layers (1+2*15+16): Top 0.035mm / dielectric 1.5mm / Layer2 0.035mm / dielectric 0.15mm / Layer3 0.035mm / dielectric 0.2mm / Bottom 0.035mm
Design rules "default *": minimum track width 6mil, minimum drill 0.6mm, track to track 6mil, track to pad 6mil, pad to pad 6mil, via to via 6mil, smd to smd 6mil, copper to edge 40mil, drill to drill 6mil, minimum pad ring 10mil, minimum via ring 8mil, stop-mask expansion 4mil, vias tented up to drill 0mil, thermal gap 10mil

### Footprints (pad centres in the part's own frame; a part is rotated, then mirrored left to right if it is on the bottom)
C1206 = smd 1.6 x 1.8: 1 -1.4,0; 2 1.4,0
DO27-15 = drill 1.499 long: A 7.62,0; C -7.62,0
1206 = smd 1.6 x 1.8: 1 -1.4,0; 2 1.4,0
1X03 = drill 1.016 long: 1 -2.54,0; 2 0,0; 3 2.54,0
W237-132 = drill 1.194 long: 1 -2.54,-0.635; 2 2.54,-0.635
SML0805 = smd 1.2 x 1.2: A 1.05,0; C -1.05,0
SOT23-3 = smd 0.8 x 0.9: 1 -0.95,-1; 2 0.95,-1; 3 0,1.1
R1206 = smd 1.6 x 1.803: 1 -1.422,0; 2 1.422,0
R2512 = smd 1.8 x 3.2: 1 -2.8,0; 2 2.8,0
SMADIODE = smd 2.54 x 2.54: A 2.349,0; C -2.349,0
1X06 = drill 1.016 long: 1 -6.35,0; 2 -3.81,0; 3 -1.27,0; 4 1.27,0; 5 3.81,0; 6 6.35,0
SOIC-16W_SIL = smd 1.9 x 0.6: 1 -4.7,4.445; 2 -4.7,3.175; 3 -4.7,1.905; 4 -4.7,0.635; 5 -4.7,-0.635; 6 -4.7,-1.905; 7 -4.7,-3.175; 8 -4.7,-4.445; 9 4.7,-4.445; 10 4.7,-3.175; 11 4.7,-1.905; 12 4.7,-0.635; 13 4.7,0.635; 14 4.7,1.905; 15 4.7,3.175; 16 4.7,4.445
LINEAR_TECHNOLOGY_LTC6803HG-4#PBF_2 = smd 2.45 x 0.25: 1 -3.425,5.25; 2 -3.425,4.75; 3 -3.425,4.25; 4 -3.425,3.75; 5 -3.425,3.25; 6 -3.425,2.75; 7 -3.425,2.25; 8 -3.425,1.75; 9 -3.425,1.25; 10 -3.425,0.75; 11 -3.425,0.25; 12 -3.425,-0.25; 13 -3.425,-0.75; 14 -3.425,-1.25; 15 -3.425,-1.75; 16 -3.425,-2.25; 17 -3.425,-2.75; 18 -3.425,-3.25; 19 -3.425,-3.75; 20 -3.425,-4.25; 21 -3.425,-4.75; 22 -3.425,-5.25; 23 3.425,-5.25; 24 3.425,-4.75; 25 3.425,-4.25; 26 3.425,-3.75; 27 3.425,-3.25; 28 3.425,-2.75; 29 3.425,-2.25; 30 3.425,-1.75; 31 3.425,-1.25; 32 3.425,-0.75; 33 3.425,-0.25; 34 3.425,0.25; 35 3.425,0.75; 36 3.425,1.25; 37 3.425,1.75; 38 3.425,2.25; 39 3.425,2.75; 40 3.425,3.25; 41 3.425,3.75; 42 3.425,4.25; 43 3.425,4.75; 44 3.425,5.25
W237-7P = drill 1.194 long: 1 -15.24,-0.635; 2 -10.16,-0.635; 3 -5.08,-0.635; 4 0,-0.635; 5 5.08,-0.635; 6 10.16,-0.635; 7 15.24,-0.635
LL-34 = smd 1.524 x 1.676: A -1.524,0; C 1.524,0

### Placement (x,y rotation side)
C_5VHOST1  80.47,65.99 180 top
C_5VHOST2  80.47,63.09 180 top
C_C0  66.32,3.3 270 top
C_CIN1  50.9,9.37 270 bottom
C_CIN2  50.9,16.99 270 bottom
C_CIN3  50.9,24.61 270 bottom
C_CIN4  50.9,32.23 270 bottom
C_CIN5  50.9,39.85 270 bottom
C_CIN6  50.9,47.47 270 bottom
C_CIN7  50.9,55.09 270 bottom
C_CIN8  50.9,62.71 270 bottom
C_CIN9  50.9,70.33 270 bottom
C_CIN10  50.9,77.95 270 bottom
C_CIN11  50.9,85.57 270 bottom
C_CIN12  50.9,93.83 270 bottom
C_COUPLINGA  83.06,71.35 180 top
C_V+1  70.56,84.58 270 top
C_V+2  74.07,84.51 270 top
C_V+LTC  70.74,91.01 270 bottom
C_VDDHV1  77.04,10.13 180 top
C_VDDHV2  74.68,65.89 180 top
C_VREF  66.22,20.22 0 bottom
C_VREG  74.7,68.76 180 top
C_VTEMP1  65.02,14.48 90 bottom
C_VTEMP2  71.65,12.67 180 bottom
D1_V+  71.78,84.94 315.7 top
D2_V+  67.21,81.56 315.8 top
F0  22.33,6.2 180 bottom
F1  20.42,9.37 180 bottom
F2  20.42,16.99 180 bottom
F3  20.42,24.61 180 bottom
F4  20.42,32.23 180 bottom
F5  20.42,39.85 180 bottom
F6  20.42,47.47 180 bottom
F7  20.42,55.09 180 bottom
F8  20.42,62.71 180 bottom
F9  20.42,70.33 180 bottom
F10  20.42,77.95 180 bottom
F11  20.42,85.57 180 bottom
F12  20.42,93.83 180 bottom
F13  22.4,3.05 0 bottom
GPIO1  90.22,16.43 90 top
GPIO2  83.74,22.83 90 top
ISODCDC  87.17,94.49 180 top
LED1  24.23,11.28 0 top
LED2  24.23,18.9 0 top
LED3  24.23,26.52 0 top
LED4  24.23,34.14 0 top
LED5  24.23,41.76 0 top
LED6  24.23,49.38 0 top
LED7  24.23,57 0 top
LED8  24.23,64.62 0 top
LED9  24.23,72.24 0 top
LED10  24.23,79.86 0 top
LED11  24.23,87.48 0 top
LED12  24.23,95.73 0 top
LED_VDDHOST  92.23,87.43 0 top
LED_VDDHV  77.47,71.7 180 top
NTC1  76.2,6.25 0 top
NTC2  90.83,6.25 0 top
PMOS1  37.57,8.1 180 top
PMOS2  37.57,15.72 180 top
PMOS3  37.57,23.34 180 top
PMOS4  37.57,30.96 180 top
PMOS5  37.57,38.58 180 top
PMOS6  37.57,46.2 180 top
PMOS7  37.57,53.82 180 top
PMOS8  37.57,61.44 180 top
PMOS9  37.57,69.06 180 top
PMOS10  37.57,76.68 180 top
PMOS11  37.57,84.3 180 top
PMOS12  37.57,92.56 180 top
R_A1  95.78,74.52 90 top
R_A2  92.89,73 90 top
R_A3  90.09,70.87 90 top
R_A4  87,67.21 90 top
R_B1.  90.02,41.76 180 top
R_B2.  90.07,38.23 180 top
R_B3.  90.02,35 180 top
R_B4.  90.02,31.78 180 top
R_C0  62.56,3.4 90 top
R_CIN0  54.71,3.66 180 bottom
R_CIN1  44.55,10.64 0 top
R_CIN2  44.55,18.26 0 top
R_CIN3  44.55,25.88 0 top
R_CIN4  44.55,33.5 0 top
R_CIN5  44.55,41.12 0 top
R_CIN6  44.55,48.74 0 top
R_CIN7  44.55,56.36 0 top
R_CIN8  44.55,63.98 0 top
R_CIN9  44.55,71.6 0 top
R_CIN10  44.55,79.22 0 top
R_CIN11  44.55,86.84 0 top
R_CIN12  44.55,95.1 0 top
R_GPIO1  91.64,22.73 0 top
R_GPIO2  91.64,26.14 0 top
R_SGATE1  43.92,6.83 0 top
R_SGATE2  43.92,14.45 0 top
R_SGATE3  43.92,22.07 0 top
R_SGATE4  43.92,29.69 0 top
R_SGATE5  43.92,37.31 0 top
R_SGATE6  43.92,44.93 0 top
R_SGATE7  43.92,52.55 0 top
R_SGATE8  43.92,60.17 0 top
R_SGATE9  43.92,67.79 0 top
R_SGATE10  43.92,75.41 0 top
R_SGATE11  43.92,83.03 0 top
R_SGATE12  43.92,91.29 0 top
R_V+  75.62,48.92 90 top
R_VDD_VREG  77.75,39.75 270 top
R_VDDHOST  86.13,87.2 0 top
R_VDDHV  77.9,74.52 0 top
R_VTEMP1  67.51,9.35 180 bottom
R_VTEMP2  68.88,15.16 0 bottom
R_WDTB  79.68,15.39 90 top
RD1  26.77,7.47 0 top
RD2  26.77,15.09 0 top
RD3  26.77,22.71 0 top
RD4  26.77,30.33 0 top
RD5  26.77,37.95 0 top
RD6  26.77,45.57 0 top
RD7  26.77,53.19 0 top
RD8  26.77,60.81 0 top
RD9  26.77,68.43 0 top
RD10  26.77,76.05 0 top
RD11  26.77,83.67 0 top
RD12  26.77,91.92 0 top
RLED1  18.52,9.37 90 top
RLED2  18.52,16.99 90 top
RLED3  18.52,24.61 90 top
RLED4  18.52,32.23 90 top
RLED5  18.52,39.85 90 top
RLED6  18.52,47.47 90 top
RLED7  18.52,55.09 90 top
RLED8  18.52,62.71 90 top
RLED9  18.52,70.33 90 top
RLED10  18.52,77.95 90 top
RLED11  18.52,85.57 90 top
RLED12  18.52,93.83 90 top
SCHOTTKY_V+  74.68,92.33 270 bottom
SPI  88.62,82.14 180 top
U1  83.46,50.04 270 top
U2  70.18,29.46 270 top
V+_LTC  64.54,94.61 0 top
X1  7.21,70.97 270 top
X2  7.21,23.34 270 top
ZEN1  55.98,9.37 90 bottom
ZEN2  55.98,16.99 90 bottom
ZEN3  55.98,24.61 90 bottom
ZEN4  55.98,32.23 90 bottom
ZEN5  55.98,39.85 90 bottom
ZEN6  55.98,47.47 90 bottom
ZEN7  55.98,55.09 90 bottom
ZEN8  55.98,62.71 90 bottom
ZEN9  55.98,70.33 90 bottom
ZEN10  55.98,77.95 90 bottom
ZEN11  55.98,85.57 90 bottom
ZEN12  55.98,93.83 90 bottom

### Tracks (layer width: path | path; a pad name or v marks a point on that pad's centre or on a via)
0V  (via drill 0.6)
  Top 0.152: 73.46,26.07 U2.40
  Top 0.254: U2.28 U2.27 66.93,27.31 68.05,28.42 v69.95,28.42 | U2.33 69.93,28.4 v69.95,28.42 | v69.95,28.42 72.47,28.42 73.43,27.46 U2.40 U2.39 U2.38 U2.37
  Top 0.508: v78.03,50.29 78.03,46.33 U1.9 | U1.15 86.64,37.87 v86.56,37.8
  Top 0.635: 78.03,51.05 v78.03,50.29 | C_V+1.2 73.99,83.18 C_V+2.2 74.22,82.95 | 66.75,1.37 66.24,1.88 66.24,1.98
  Top 1.016: 62.2,1.63 R_C0.1 | R_C0.1 66.24,1.98 C_C0.2 | v47.09,1.63 61.37,1.63 61.72,1.98 R_C0.1 | C_VDDHV2.2 73.3,65.91 C_VREG.2 73.3,71.34 R_VDDHV.1 74.76,76.25 D2_V+.A | C_V+2.2 77.23,79.94 D1_V+.A | C_VDDHV1.2 73.76,10.13 v65.76,18.14
  Layer2 1.016: ISODCDC.1 89.71,94.59 85.65,90.53 81.31,90.53 77.23,86.45 D1_V+.A 76.04,79.62 D2_V+.A 78.03,70.89 v78.03,50.29 78.03,46.33 v86.56,37.8 77.19,28.42 v69.95,28.42 67.28,25.76 64.01,25.76 61,22.75 | v47.09,1.63 59.16,1.63 | 61,22.75 59.28,21.03 59.28,1.75 59.16,1.63 | v65.76,18.14 61.15,22.75 61,22.75 | 59.16,1.63 78.87,1.63 | 78.87,1.63 90.7,1.63 93.65,4.57 93.65,5.33 NTC2.2 93.37,10.74 GPIO1.1 87,13.89 83.74,17.14 GPIO2.1 | NTC1.2 78.74,1.75 78.87,1.63
  Bottom 0.635: v65.76,18.14 65.61,18.29 | v65.76,18.14 65.02,17.4 C_VTEMP1.2 | C_VTEMP2.2 73.05,11.3 NTC1.2 | v65.76,18.14 64.82,19.08 C_VREF.2 64.82,23.29 v69.95,28.42
  Bottom 1.016: C_CIN12.2 50.9,91.92 47.09,88.11 47.09,84.3 | C_CIN11.2 47.22,84.17 47.09,84.3 | C_CIN10.2 47.22,76.55 47.09,76.68 | 47.09,76.68 47.09,84.3 | C_CIN9.2 47.22,68.93 47.09,69.06 | 47.09,69.06 47.09,76.68 | C_CIN8.2 47.22,61.31 47.09,61.44 | 47.09,61.44 47.09,69.06 | C_CIN7.2 47.22,53.69 47.09,53.82 | 47.09,53.82 47.09,61.44 | C_CIN6.2 50.77,46.2 47.09,46.2 | 47.09,46.2 47.09,53.82 | C_CIN5.2 47.22,38.45 47.09,38.58 | 47.09,38.58 47.09,46.2 | C_CIN4.2 47.22,30.83 47.09,30.96 | 47.09,30.96 47.09,38.58 | C_CIN3.2 47.22,23.21 47.09,23.34 | 47.09,23.34 47.09,30.96 | C_CIN2.2 47.22,15.59 47.09,15.72 | 47.09,15.72 47.09,23.34 | C_CIN1.2 47.22,7.97 47.09,8.1 | 47.09,8.1 47.09,15.72 | 47.09,8.1 v47.09,1.63 45.67,3.05 F13.1 | C_V+LTC.2 71.11,89.98 SCHOTTKY_V+.A 85.56,89.98 89.76,94.18 89.76,95.07 ISODCDC.1 | 93.37,4.52 NTC2.2
5V_HOST  (via drill 0.6)
  Top 0.305: C_COUPLINGA.1 84.46,71.6
  Top 0.381: C_5VHOST1.1 C_5VHOST2.1 81.87,62.91 82.6,62.18
  Top 0.508: U1.7 80.33,54.78 80.33,59.91 82.6,62.18 84.46,64.04 C_COUPLINGA.1 84.46,76.48 79.86,81.08 79.86,83.52 81.38,85.04 94.18,85.04 v96.32,87.17 | U1.1 89.38,54.74 97.77,63.13 97.77,85.72 96.06,87.43
  Top 1.016: LED_VDDHOST.A 96.06,87.43 v96.32,87.17
  Bottom 1.016: v96.32,87.17 94.97,85.83 SPI.1
C0
  Bottom 1.016: ZEN1.A 55.98,3.81 R_CIN0.2
C1  (via drill 0.4 pad 0.25, 0.6)
  Top 0.254: U2.24 v65.43,28.3
  Top 1.016: R_CIN1.2 v53.44,10.64
  Bottom 0.635: ZEN2.A 58.37,17.86 58.37,21.23 v65.43,28.3
  Bottom 1.016: ZEN2.A ZEN1.C 55.98,10.64 v53.44,10.64 51.03,10.64 C_CIN1.1
C2  (via drill 0.4 pad 0.25, 0.6)
  Top 0.254: U2.22 v64.93,30.64 v64.92,30.63
  Top 1.016: R_CIN2.2 v53.44,18.26 53.47,18.29
  Bottom 0.635: v64.92,30.63 57.38,23.09 ZEN3.A
  Bottom 1.016: ZEN3.A ZEN2.C 55.73,18.26 v53.44,18.26 51.03,18.26 C_CIN2.1
C3  (via drill 0.4 pad 0.25, 0.6)
  Top 0.254: U2.20 65.93,29.81 65.91,29.79 v65.95,29.76
  Top 1.016: R_CIN3.2 v53.44,25.88
  Bottom 0.635: v65.95,29.76 65.95,32.27 65.76,32.46 57.73,32.46 ZEN4.A
  Bottom 1.016: ZEN4.A ZEN3.C 55.73,25.88 v53.44,25.88 51.03,25.88 C_CIN3.1
C4  (via drill 0.4 pad 0.25, 0.6)
  Top 0.254: 66.98,30.63 v66.93,30.68 U2.18
  Top 1.016: R_CIN4.2 v53.44,33.5
  Bottom 0.635: v66.93,30.68 66.93,33.3 66.93,33.73 62.33,38.33 ZEN5.A
  Bottom 1.016: ZEN5.A ZEN4.C 55.98,33.5 v53.44,33.5 51.03,33.5 C_CIN4.1
C5  (via drill 0.4 pad 0.25, 0.6)
  Top 0.254: U2.16 67.93,30.06 67.97,30.02 v67.95,30
  Top 1.016: R_CIN5.2 v53.44,41.12
  Bottom 0.635: v67.95,30 67.95,30.26 67.88,30.33 67.88,34.76 56.24,46.41 55.98,46.15 ZEN6.A
  Bottom 1.016: ZEN6.A ZEN5.C 55.73,41.12 v53.44,41.12 51.03,41.12 C_CIN5.1
C6  (via drill 0.4 pad 0.25, 0.6)
  Top 0.254: U2.14 68.93,30.59 68.96,30.56 68.89,30.56 v68.75,30.69
  Top 1.016: R_CIN6.2 v53.44,48.74
  Bottom 0.635: v68.75,30.69 68.75,40.8 ZEN7.A
  Bottom 1.016: C_CIN6.1 51.03,48.74 v53.44,48.74 55.73,48.74 ZEN6.C ZEN7.A
C7  (via drill 0.4 pad 0.25, 0.6)
  Top 0.254: U2.12 69.93,30.1 69.84,30 v69.77,30.07
  Top 1.016: R_CIN7.2 v53.44,56.36
  Bottom 0.635: v69.77,30.07 69.77,42.83 ZEN7.C
  Bottom 1.016: ZEN8.A ZEN7.C 55.73,56.36 v53.44,56.36 51.03,56.36 C_CIN7.1
C8  (via drill 0.4 pad 0.25, 0.6)
  Top 0.254: U2.10 70.93,30.57 70.94,30.56 70.94,30.63 v70.91,30.66
  Top 1.016: R_CIN8.2 v53.44,63.98
  Bottom 0.635: v70.91,30.66 70.91,49 70.91,49.31 70.91,53.88 ZEN9.A
  Bottom 1.016: C_CIN8.1 51.03,63.98 v53.44,63.98 55.73,63.98 ZEN8.C ZEN9.A
C9  (via drill 0.4 pad 0.25, 0.6)
  Top 0.254: U2.8 v71.93,30
  Top 1.016: R_CIN9.2 v53.44,71.6
  Bottom 0.635: v71.93,30 71.93,55.91 ZEN9.C
  Bottom 1.016: ZEN10.A ZEN9.C 55.73,71.6 v53.44,71.6 51.03,71.6 C_CIN9.1
C10  (via drill 0.4 pad 0.25, 0.6)
  Top 0.254: U2.6 72.93,30.71 72.92,30.71 v72.92,30.56
  Top 1.016: R_CIN10.2 v53.44,79.22
  Bottom 0.635: v72.92,30.56 72.92,67.11 ZEN11.A
  Bottom 1.016: C_CIN10.1 51.03,79.22 v53.44,79.22 55.73,79.22 ZEN10.C ZEN11.A
C11  (via drill 0.4 pad 0.25, 0.6)
  Top 0.254: U2.4 73.93,30.8 73.91,30.79 v73.91,29.97
  Top 1.016: R_CIN11.2 v53.44,86.84
  Bottom 0.635: v73.91,29.97 73.91,69.16 ZEN11.C
  Bottom 1.016: 50.77,86.84 C_CIN11.1 51.03,86.84 v53.44,86.84 55.73,86.84 ZEN11.C | ZEN11.C 55.86,86.97 | ZEN11.C 56.24,86.84 | ZEN12.A ZEN11.C
C12  (via drill 0.4 pad 0.25, 0.6)
  Top 0.254: U2.2 74.93,30.91 74.98,30.86 v74.98,30.79
  Top 1.016: 46.1,95.23 R_CIN12.2 v53.44,95.1
  Bottom 0.635: v74.98,30.79 74.98,69.8 66.83,77.95 66.83,85.5 57.23,95.1 55.73,95.1
  Bottom 1.016: C_CIN12.1 51.03,95.1 v53.44,95.1 55.73,95.1 ZEN12.C
CELL1+
  Bottom 1.016: F1.1 17.55,9.37 8.64,18.29 6.6,18.29 X2.5
CELL1-
  Bottom 1.016: F0.1 21,6.12 F13.2 18.26,3.05 13.21,8.1 X2.7
CELL2+
  Bottom 1.016: F2.1 14.71,16.99 8.36,23.34 X2.4
CELL3+
  Bottom 1.016: F3.1 13.74,24.61 9.93,28.42 X2.3
CELL4+
  Bottom 1.016: F4.1 14.07,32.23 12.8,33.5 X2.2
CELL5+
  Bottom 1.016: X2.1 7.85,39.85 F5.1
CELL6+
  Bottom 1.016: F6.1 14.07,47.47 6.58,54.97 X1.7
CELL7+
  Bottom 1.016: F7.1 14.71,55.09 8.99,60.81 X1.6
CELL8+
  Bottom 1.016: F8.1 15.34,62.71 12.17,65.89 X1.5
CELL9+
  Bottom 1.016: F9.1 15.34,70.33 14.71,70.97 X1.4
CELL10+
  Bottom 1.016: F10.1 14.71,77.95 12.8,76.05 X1.3
CELL11+
  Bottom 1.016: F11.1 14.71,85.57 10.26,81.13 X1.2
CELL12+
  Bottom 1.016: 17.78,93.98 21.82,98.02 60.4,98.02 62,96.42 V+_LTC.1
  Bottom 1.524: X1.1 10.01,86.21 17.78,93.98 18.87,93.98 F12.1
GND_HOST  (via drill 0.6)  (2 unrouted)
  Top 0.305: R_VDDHOST.1 84.58,87.33 | 81.05,71.96 C_COUPLINGA.2 81.69,71.35 82.3,71.35
  Top 0.508: C_COUPLINGA.2 81.66,78.06 78.33,81.38 78.33,84.73 81.08,87.48 v82.3,87.48 | U1.2 86.64,55.85 94.34,63.55 v94.94,63.55 | U1.8 79.02,68.68 81.69,71.35
  Top 1.016: v82.3,87.48 84.43,87.48 84.58,87.33
  Bottom 1.016: v82.3,87.48 82.3,82.17 SPI.6 82.3,82.12 82.3,76.2 v94.94,63.55
N$1  (1 unrouted)
  Top 0.635: R_V+.1 75.67,47.45 75.67,33.45
N$2
  Top 1.016: PMOS1.1 40.23,9.1 R_SGATE1.1
N$3
  Top 1.016: LED1.A 29.09,7.47 RD1.2 30.04,7 PMOS1.3
N$4
  Top 0.508: R_A2.1 92.89,66.09 84.1,57.3 U1.4
N$5
  Top 1.016: R_VDDHOST.2 87.78,87.43 LED_VDDHOST.C
N$6
  Top 1.016: RLED1.2 19,11.28 LED1.C
N$7  (via drill 0.6)
  Top 1.016: RLED1.1 23.49,7.95 RD1.1 25.91,5.53 | 25.91,5.53 v25.91,5.64 | v50.9,3.66 27.74,3.66 26.21,5.18 26.21,5.23 25.91,5.53
  Bottom 1.016: R_CIN0.1 v50.9,3.66 | v25.91,5.64 25.35,6.2 F0.2
N$8
  Top 0.254: U2.34 70.43,24.41 70.18,24.16
  Top 0.635: R_WDTB.2 76.68,16.81 70.18,23.32 70.18,24.16
N$9
  Layer3 1.016: V+_LTC.3 67.08,96.04 69.11,98.07 81.69,98.07 ISODCDC.2
N$10
  Top 1.016: LED_VDDHV.C 79.32,72.51 R_VDDHV.2
N$12
  Top 1.016: PMOS2.1 40.23,16.72 R_SGATE2.1
N$15
  Top 0.254: U2.43 74.93,27.61 75.44,28.12
  Top 0.305: 81.61,45.39 U1.11
  Top 0.508: 77.75,38.43 R_VDD_VREG.2 78.26,38.33 81.56,41.63 U1.11 | 88.7,51.51 92.05,51.51 96.32,47.24 96.32,35.97 91.75,31.39 91.44,31.7 R_B4..1
  Top 0.61: U1.11 81.56,47.73 85.34,51.51 88.7,51.51
  Top 0.635: R_VDD_VREG.2 77.75,37.39 79.63,35.51 79.63,32.31 75.44,28.12
N$16
  Top 1.016: LED2.A 29.09,15.09 | 29.09,15.09 RD2.2 | PMOS2.3 29.56,14.62 29.09,15.09
N$17
  Top 1.016: RLED2.2 19,18.9 LED2.C
N$18  (via drill 0.6)
  Top 1.016: v36.3,11.28 36.3,9.42 PMOS1.2 | v36.3,11.28 42.49,11.28 R_CIN1.1 | RLED2.1 23.49,15.57 RD2.1 24.87,15.09 28.68,11.28 v36.3,11.28
  Bottom 1.016: F1.2 34.39,9.37 v36.3,11.28
N$19  (via drill 0.6)
  Top 0.254: U2.42 74.43,28.1 74.45,28.12
  Top 0.508: 85.95,50.29 90.83,50.29 94.94,46.18 94.94,37.64 92.3,35 R_B3..1 | U1.12 82.83,37.26 v82.07,36.5
  Top 0.61: U1.12 82.83,47.17 85.95,50.29
  Top 0.635: v77.19,31.7 77.19,31.39 74.45,28.65 74.45,28.12
  Bottom 0.508: v82.07,36.5 81.99,36.5 v77.19,31.7
N$20
  Top 0.254: 75.43,27.27 U2.44 76.33,26.04 76.5,26.21
  Top 0.508: R_B2..1 92.18,38.23 93.57,39.62 93.57,44.81 89.31,49.07 86.26,49.07
  Top 0.61: U1.13 84.1,46.91 86.26,49.07
  Top 0.635: U1.13 84.1,33.81 76.5,26.21
N$21
  Top 1.016: PMOS3.1 40.23,24.34 R_SGATE3.1
N$22
  Top 0.254: U2.41 73.93,24.21 74.3,23.85
  Top 0.508: 86.56,47.85 88.09,47.85 91.44,44.5 R_B1..1
  Top 0.61: U1.14 85.37,46.66 86.56,47.85
  Top 0.635: U1.14 85.37,31.88 77.34,23.85 74.3,23.85
N$23
  Top 0.508: R_A3.1 90.09,65.63 82.83,58.37 U1.5
N$24
  Top 0.508: U1.3 85.37,56.57 95.78,66.98 R_A1.1
N$25
  Top 1.016: LED3.A 29.09,22.71 RD3.2 29.25,23.02 28.99,23.02 29.95,22.07 30.12,22.24 PMOS3.3
N$26
  Top 1.016: RLED3.2 19,26.52 LED3.C
N$27  (via drill 0.6)
  Top 1.016: PMOS2.2 36.3,17.04 v36.3,18.9 | v36.3,18.9 42.49,18.9 R_CIN2.1 | v36.3,18.9 28.68,18.9 24.87,22.71 RD3.1 23.49,23.19 RLED3.1
  Bottom 1.016: v36.3,18.9 34.39,16.99 25.3,16.99 F2.2
N$28
  Top 0.508: U1.6 81.56,59.44 87,64.87 R_A4.1
N$29
  Top 0.152: 66.3,4.73 C_C0.1
  Top 0.254: U2.26 66.43,24.44 65.15,23.16
  Top 0.635: R_C0.2 60.88,6.5 60.88,19.89 62.79,21.79 64.16,23.16 65.15,23.16
  Top 1.016: R_C0.2 66.2,4.83 66.3,4.73
N$30
  Top 1.016: PMOS4.1 40.23,31.96 R_SGATE4.1
N$31  (via drill 0.6)
  Top 0.254: U2.36 71.43,24.73 72.08,24.08 72.39,24.08
  Top 0.635: v77.11,21.34 75.13,21.34 72.39,24.08
  Layer2 1.016: v77.11,21.34 78.61,22.84 GPIO2.2
N$32  (via drill 0.6)
  Top 0.254: U2.35 70.93,24.17 71.32,23.77 71.32,23.62
  Top 0.635: 71.32,23.62 75.59,19.36 81.23,19.36 84.12,16.46 v87.48,16.46
  Layer2 1.016: GPIO1.2 87.5,16.43 v87.48,16.46
N$33  (via drill 0.6)
  Top 0.254: U2.30 68.43,23.85 67.89,23.32
  Top 0.635: v71.93,16.76 70.94,16.76 67.89,19.81 67.89,23.32
  Bottom 0.635: C_VTEMP2.1 69.88,13.05 69.88,13.18 70.31,13.61 R_VTEMP2.1 71.83,16.69 72.01,16.69
  Bottom 1.016: v71.93,16.76 72.01,16.69 78.26,16.69 88.29,6.66 NTC2.1
N$34
  Top 1.016: LED4.A 29.09,30.33 | 29.09,30.33 RD4.2 | PMOS4.3 29.56,29.86 29.09,30.33
N$35
  Top 1.016: RLED4.2 19,34.14 LED4.C
N$36  (via drill 0.6)
  Top 1.016: RLED4.1 23.49,30.81 | 23.49,30.81 RD4.1 | PMOS3.2 36.3,24.66 v36.3,26.52 | v36.3,26.52 42.49,26.52 R_CIN3.1 | v36.3,26.52 28.68,26.52 24.38,30.81 23.49,30.81
  Bottom 1.016: v36.3,26.52 34.39,24.61 F3.2
N$37  (via drill 0.6)
  Top 0.254: U2.29 67.93,24.57 67.59,24.23 67.13,24.23 66.75,23.85 66.75,23.77
  Top 0.635: 66.75,23.77 66.75,23.16 65.46,21.87 64.54,21.87 62.71,20.04 v62.71,9.83
  Bottom 0.635: C_VTEMP1.1 65.02,10.41 R_VTEMP1.1 65.61,9.83 v62.71,9.83
  Bottom 1.016: v62.71,9.83 66.93,5.61 NTC1.1
N$38  (via drill 0.6)
  Top 1.016: v88.09,25.91 89.99,25.91 R_GPIO2.1
  Layer2 1.016: GPIO2.3 87.55,25.38 v88.09,25.91
N$39
  Top 1.016: PMOS5.1 40.23,39.58 R_SGATE5.1
N$40  (via drill 0.6)
  Top 1.016: v88.09,22.55 88.27,22.73 R_GPIO1.1
  Layer2 1.016: v88.09,22.55 90.22,20.42 GPIO1.3
N$43
  Top 1.016: LED5.A 29.09,37.95 | 29.09,37.95 RD5.2 | PMOS5.3 29.56,37.48 29.09,37.95
N$44
  Top 1.016: RLED5.2 19,41.76 LED5.C
N$45  (via drill 0.6)
  Top 1.016: RLED5.1 23.49,38.43 | 23.49,38.43 RD5.1 | PMOS4.2 36.3,32.28 v36.3,34.14 | v36.3,34.14 42.49,34.14 R_CIN4.1 | v36.3,34.14 28.68,34.14 24.38,38.43 23.49,38.43
  Bottom 1.016: v36.3,34.14 34.39,32.23 F4.2
N$48
  Top 1.016: PMOS6.1 40.23,47.2 R_SGATE6.1
N$52
  Top 1.016: LED6.A 29.09,45.57 RD6.2 30.04,45.1 PMOS6.3
N$53
  Top 1.016: RLED6.2 19,49.38 LED6.C
N$54  (via drill 0.6)
  Top 1.016: RLED6.1 23.49,46.05 | 23.49,46.05 RD6.1 | v36.3,41.76 36.3,39.9 PMOS5.2 | v36.3,41.76 42.49,41.76 R_CIN5.1 | v36.3,41.76 28.68,41.76 24.38,46.05 23.49,46.05
  Bottom 1.016: F5.2 34.39,39.85 v36.3,41.76
N$57
  Top 1.016: PMOS7.1 40.23,54.82 R_SGATE7.1
N$61
  Top 1.016: LED7.A 29.09,53.19 RD7.2 30.04,52.72 PMOS7.3
N$62
  Top 1.016: RLED7.2 19,57 LED7.C
N$63  (via drill 0.6)
  Top 1.016: RLED7.1 23.49,53.67 | 23.49,53.67 RD7.1 | v36.3,49.38 36.3,47.52 PMOS6.2 | v36.3,49.38 42.49,49.38 R_CIN6.1 | v36.3,49.38 28.68,49.38 24.38,53.67 23.49,53.67
  Bottom 1.016: F6.2 34.39,47.47 v36.3,49.38
N$66
  Top 1.016: PMOS8.1 40.23,62.44 R_SGATE8.1
N$70
  Top 1.016: LED8.A 29.73,60.17 29.95,60.17 29.95,60.43 | 29.95,60.43 RD8.2 | PMOS8.3 30.04,60.34 29.95,60.43
N$71
  Top 1.016: RLED8.2 19,64.62 LED8.C
N$72  (via drill 0.6)
  Top 1.016: RLED8.1 23.49,61.29 RD8.1 24.87,60.81 28.68,57 v36.3,57 | v36.3,57 36.3,55.14 PMOS7.2 | v36.3,57 42.49,57 R_CIN7.1
  Bottom 1.016: F7.2 34.39,55.09 v36.3,57
N$75
  Top 1.016: PMOS9.1 40.23,70.06 R_SGATE9.1
N$79
  Top 1.016: PMOS9.3 29.48,67.96 | 29.48,67.96 29.31,67.79 29.31,68.17 RD9.2 | LED9.A 29.48,68.04 29.48,67.96
N$80
  Top 1.016: RLED9.2 19,72.24 LED9.C
N$81  (via drill 0.6)
  Top 1.016: RLED9.1 23.49,68.91 | 23.49,68.91 RD9.1 | PMOS8.2 36.3,62.76 v36.3,64.62 | v36.3,64.62 42.49,64.62 R_CIN8.1 | v36.3,64.62 28.68,64.62 24.38,68.91 23.49,68.91
  Bottom 1.016: v36.3,64.62 34.39,62.71 F8.2
N$84
  Top 1.016: PMOS10.1 40.23,77.68 R_SGATE10.1
N$88
  Top 1.016: PMOS10.3 30.04,75.58 | 30.04,75.58 RD10.2 | LED10.A 29.56,75.58 30.04,75.58
N$89
  Top 1.016: RLED10.2 19,79.86 LED10.C
N$90  (via drill 0.6)
  Top 1.016: RLED10.1 23.49,76.53 RD10.1 24.87,76.05 28.68,72.24 v36.3,72.24 | PMOS9.2 36.3,70.38 v36.3,72.24 | v36.3,72.24 42.49,72.24 R_CIN9.1
  Bottom 1.016: v36.3,72.24 34.39,70.33 F9.2
N$93
  Top 1.016: PMOS11.1 40.23,85.3 R_SGATE11.1
N$97
  Top 1.016: PMOS11.3 29.57,83.2 | LED11.A 29.56,83.2 29.57,83.2 | RD11.2 29.57,83.2
N$98
  Top 1.016: RLED11.2 19,87.48 LED11.C
N$99  (via drill 0.6)
  Top 1.016: R_CIN10.1 42.49,79.86 v36.3,79.86 | PMOS10.2 36.3,78 v36.3,79.86 | RLED11.1 23.49,84.15 | 23.49,84.15 RD11.1 | v36.3,79.86 28.68,79.86 24.38,84.15 23.49,84.15
  Bottom 1.016: v36.3,79.86 34.39,77.95 F10.2
N$102
  Top 1.016: PMOS12.1 40.23,93.56 R_SGATE12.1
N$105  (via drill 0.6)
  Top 1.016: PMOS12.2 36.62,95.29 v36.3,95.61 42.62,95.61 R_CIN12.1
  Bottom 1.016: v36.3,95.61 34.52,93.83 F12.2
N$106
  Top 1.016: LED12.A 29.73,91.29 | 29.73,91.29 29.95,91.29 29.95,91.55 RD12.2 | PMOS12.3 29.9,91.46 29.73,91.29
N$107
  Top 1.016: RLED12.2 19,95.73 LED12.C
N$108  (via drill 0.6)
  Top 1.016: v36.3,87.48 42.49,87.48 R_CIN11.1 | 24.23,91.92 RD12.1 23.49,92.41 | 18.67,92.56 RLED12.1 23.49,92.41 | v36.3,87.48 29.31,87.48 24.38,92.41 23.49,92.41 | PMOS11.2 36.3,85.62 v36.3,87.48
  Bottom 1.016: v36.3,87.48 34.39,85.57 F11.2
S1
  Top 0.254: 65.93,24.78 U2.25 65.93,24.63 65.53,24.23 64.16,24.23
  Top 0.635: R_SGATE1.2 53.54,6.83 57.91,11.2 57.91,18.75 63.4,24.23 64.16,24.23
S2
  Top 0.254: U2.23 64.03,26.04 64.01,26.06
  Top 0.635: 64.01,26.06 63.5,26.06 51.89,14.45
  Top 1.016: R_SGATE2.2 51.89,14.45
S3
  Top 0.254: 57.73,22.38 57.73,22.07 | U2.21 65.43,34.47 65.15,34.75 63.4,34.75
  Top 0.635: 57.73,22.07 62.1,26.44 62.1,33.45 63.4,34.75
  Top 1.016: R_SGATE3.2 57.73,22.07 57.91,22.25
S4
  Top 0.254: U2.19 66.34,32.98 66.34,34.48 66,34.82
  Top 0.305: 58.62,29.69 58.52,29.69
  Top 0.635: 58.52,29.69 60.88,32.05 60.88,34.29 62.55,35.95 64.86,35.95 66,34.82
  Top 1.016: R_SGATE4.2 58.52,29.69
S5
  Top 0.254: U2.17 67.43,35.05
  Top 0.305: 58.9,37.31 58.52,37.31
  Top 0.508: 58.52,37.31 58.65,37.31
  Top 0.635: 67.43,35.05 65.17,37.31 58.52,37.31
  Top 1.016: R_SGATE5.2 58.52,37.31
S6
  Top 0.254: U2.15 68.43,35.05
  Top 0.635: 68.43,35.05 68.43,36.42 59.92,44.93 58.52,44.93
  Top 1.016: 58.52,44.93 R_SGATE6.2
S7
  Top 0.254: U2.13 69.43,35.05 | 58.52,52.55 58.66,52.41
  Top 0.635: 69.43,35.05 69.43,41.67 58.55,52.55 58.52,52.55
  Top 1.016: 58.52,52.55 R_SGATE7.2
S8
  Top 0.254: U2.11 70.43,35.2 | 58.52,60.17 58.81,59.88
  Top 0.635: 70.43,35.2 70.43,42.42 60.35,52.5 60.35,58.34 58.52,60.17
  Top 1.016: 58.52,60.17 R_SGATE8.2
S9
  Top 0.254: U2.9 71.43,35.05
  Top 0.635: 71.43,35.05 71.43,43.17 61.87,52.73 61.87,65.15 59.23,67.79 58.52,67.79
  Top 1.016: 58.52,67.79 R_SGATE9.2
S10
  Top 0.254: U2.7 72.43,34.59 72.43,35.05
  Top 0.635: 72.43,34.59 72.43,43.7 63.55,52.58 63.55,70.38 58.52,75.41
  Top 1.016: 58.52,75.41 R_SGATE10.2
S11
  Top 0.254: U2.5 73.43,34.59 73.43,34.9
  Top 0.635: 73.43,34.59 73.43,44.68 65.3,52.81 65.3,76.25 58.52,83.03
  Top 1.016: 58.52,83.03 R_SGATE11.2
S12
  Top 0.254: U2.3 74.43,34.9
  Top 0.635: 74.43,34.9 74.43,45.51 72.16,47.78 72.08,47.78 66.75,53.11 66.75,85.88 61.34,91.29
  Top 0.762: 61.34,91.29 R_SGATE12.2
SPI_CHIPSELECT  (via drill 0.6)
  Top 1.016: v89.92,78.94 92.89,75.97 R_A2.2
  Bottom 1.016: SPI.3 89.92,82.12 v89.92,78.94
SPI_CLOCK  (via drill 0.6)
  Top 1.016: R_A1.2 95.78,76.73 v94.18,78.33
  Bottom 1.016: v94.18,78.33 92.43,80.09 SPI.2
SPI_MASTERIN  (via drill 0.6)
  Top 1.016: v85.04,78.94 87,76.99 R_A4.2
  Bottom 1.016: SPI.5 84.81,79.17 v85.04,78.94
SPI_MASTEROUT  (via drill 0.6)
  Top 1.016: R_A3.2 90.09,75.11 v89.92,75.29
  Bottom 1.016: v89.92,75.29 87.35,77.85 SPI.4
V+_LTC
  Top 0.635: 68.5,88.08 70.56,86.03 C_V+1.1 73.99,85.98 C_V+2.1 | D1_V+.C 68.39,88.2 68.5,88.08 | R_V+.2 68.5,57.45 68.5,88.08
  Top 1.016: R_V+.2 75.62,50.72
  Layer3 1.016: D2_V+.C 65.13,90.26 D1_V+.C 64.54,92.05 V+_LTC.2
  Bottom 1.016: 64.31,94.38 V+_LTC.2 | SCHOTTKY_V+.C 73.01,94.68 C_V+LTC.1 70.28,91.95 68.02,91.95 D1_V+.C 66.98,89.61
VREF  (via drill 0.6)
  Top 0.254: U2.31 68.93,20.68 v70.1,19.51
  Bottom 0.635: R_VTEMP1.2 67.46,10.82 67.46,14.71 R_VTEMP2.2 67.46,20.06 C_VREF.1 68.36,19.48 70.13,19.48 v70.1,19.51
VREG
  Top 0.254: 78.99,13.97 R_WDTB.1 | C_VREG.1 76.1,65.86 76.24,65.72 | U2.32 69.43,23.08 69.43,22.7 69.72,22.4
  Top 0.508: U1.10 80.29,43.59 80.16,43.59 R_VDD_VREG.1 78.97,42.4 | U1.16 87.91,42.44 R_B1..2 | 88.39,52.73 93.27,52.73 97.77,48.23 97.77,30.84 R_GPIO2.2 | C_VDDHV2.1 76.24,65.72 76.46,65.51 76.46,54.84 78.56,52.73 80.47,52.73 | 80.47,52.73 85.95,52.73 | 80.29,47.68 80.29,52.55 80.47,52.73
  Top 0.61: U1.10 80.29,47.68 | 85.34,52.73 85.95,52.73 88.39,52.73
  Top 0.635: C_VDDHV1.1 79.68,11.38 R_WDTB.1 77.77,13.97 69.72,22.02 69.72,22.4
  Top 1.016: C_VDDHV2.1 76.1,65.91 C_VREG.1 76.1,71.39 LED_VDDHV.A | R_WDTB.1 82.68,10.97 92.35,10.97 95.1,13.72 95.1,20.7 R_GPIO1.2 R_GPIO2.2 93.06,26.72 88.7,31.09 88.7,31.67 R_B4..2 R_B3..2 88.65,35.05 R_B2..2 88.6,38.28 R_B1..2
(copper drawn outside any net)
  shapes: Top area x2

### Text on the board
tPlace: C12+ | ISO+ | ISO+ | GND- | CELL 12+ | CLK | 5V | CS | GND | M.IN | M.OUT | CELL 6+ | CELL 5+ | VREG | GPIO2 | GND | VREG | GPIO1 | GND | CELL 1- | ANARGYA @2022 | D | G | D | G